# EAGLE board smoothieboard-10x10-1210 (EAGLE 9.6.0), part 1 of 3
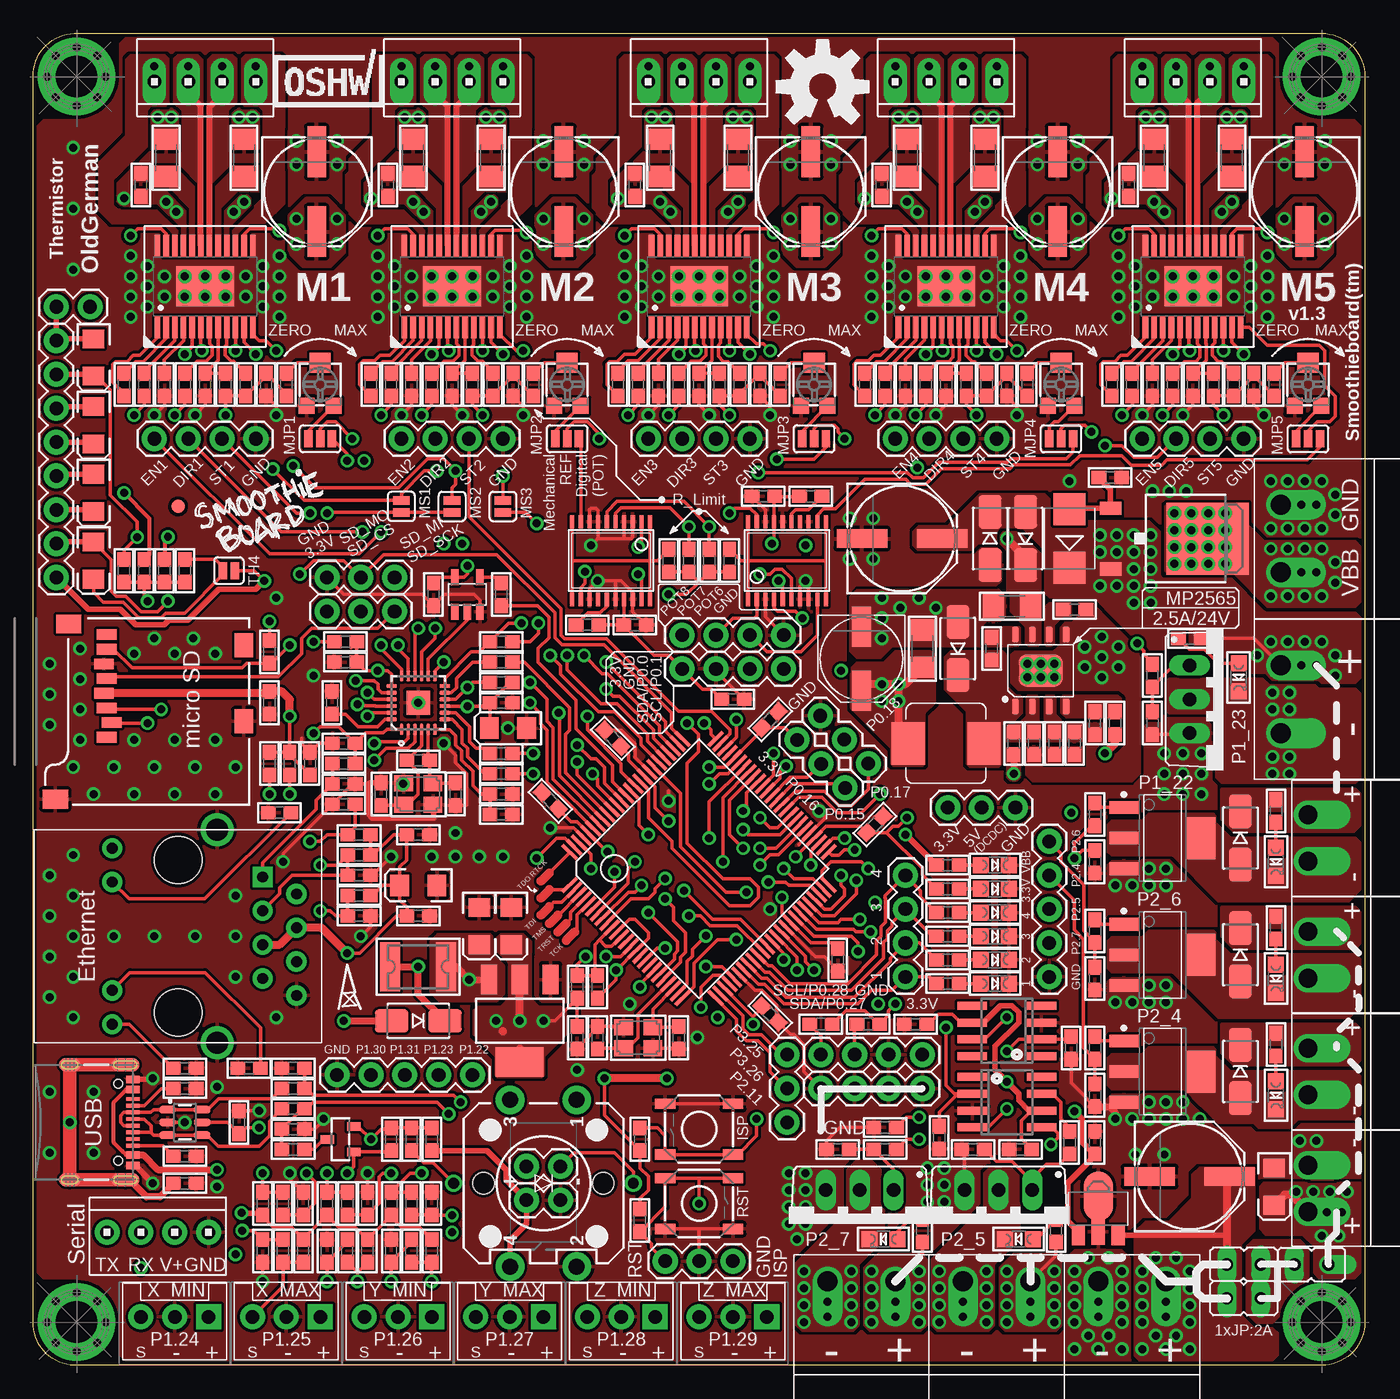
[diagram p4: board, top side]
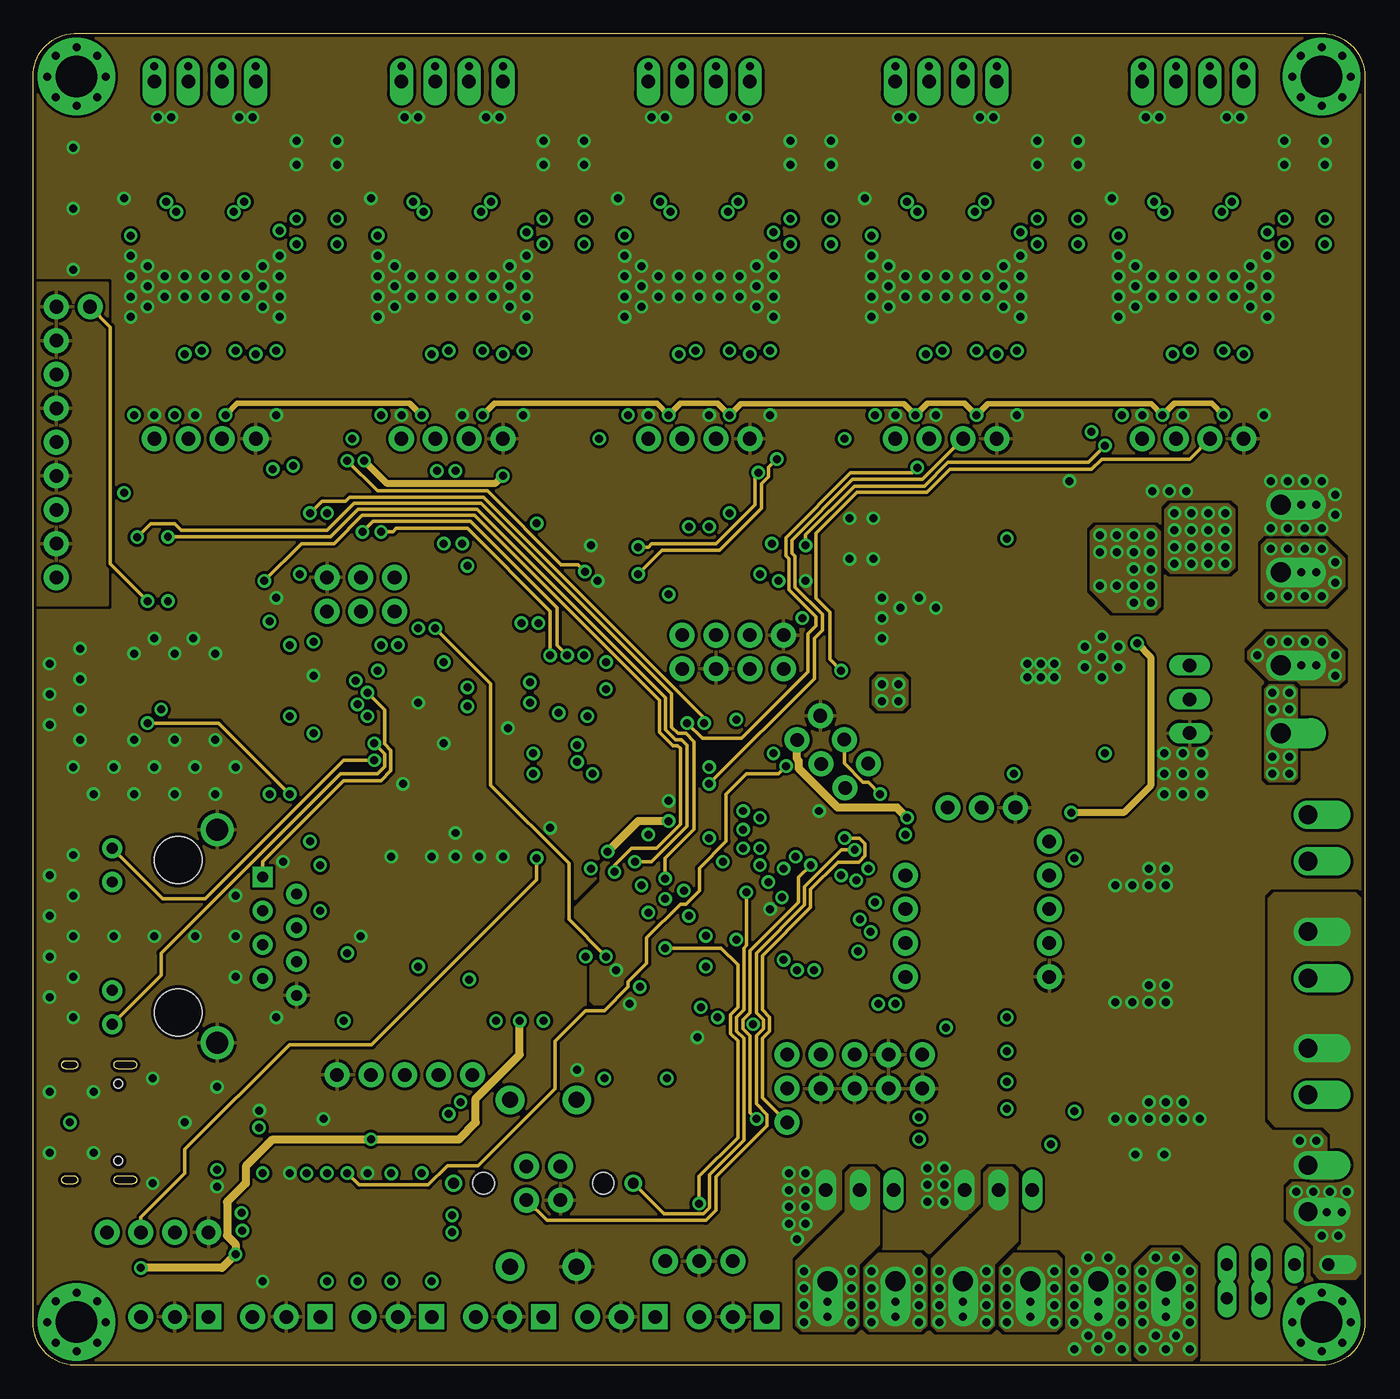
[diagram p5: board, inner layer Route2]
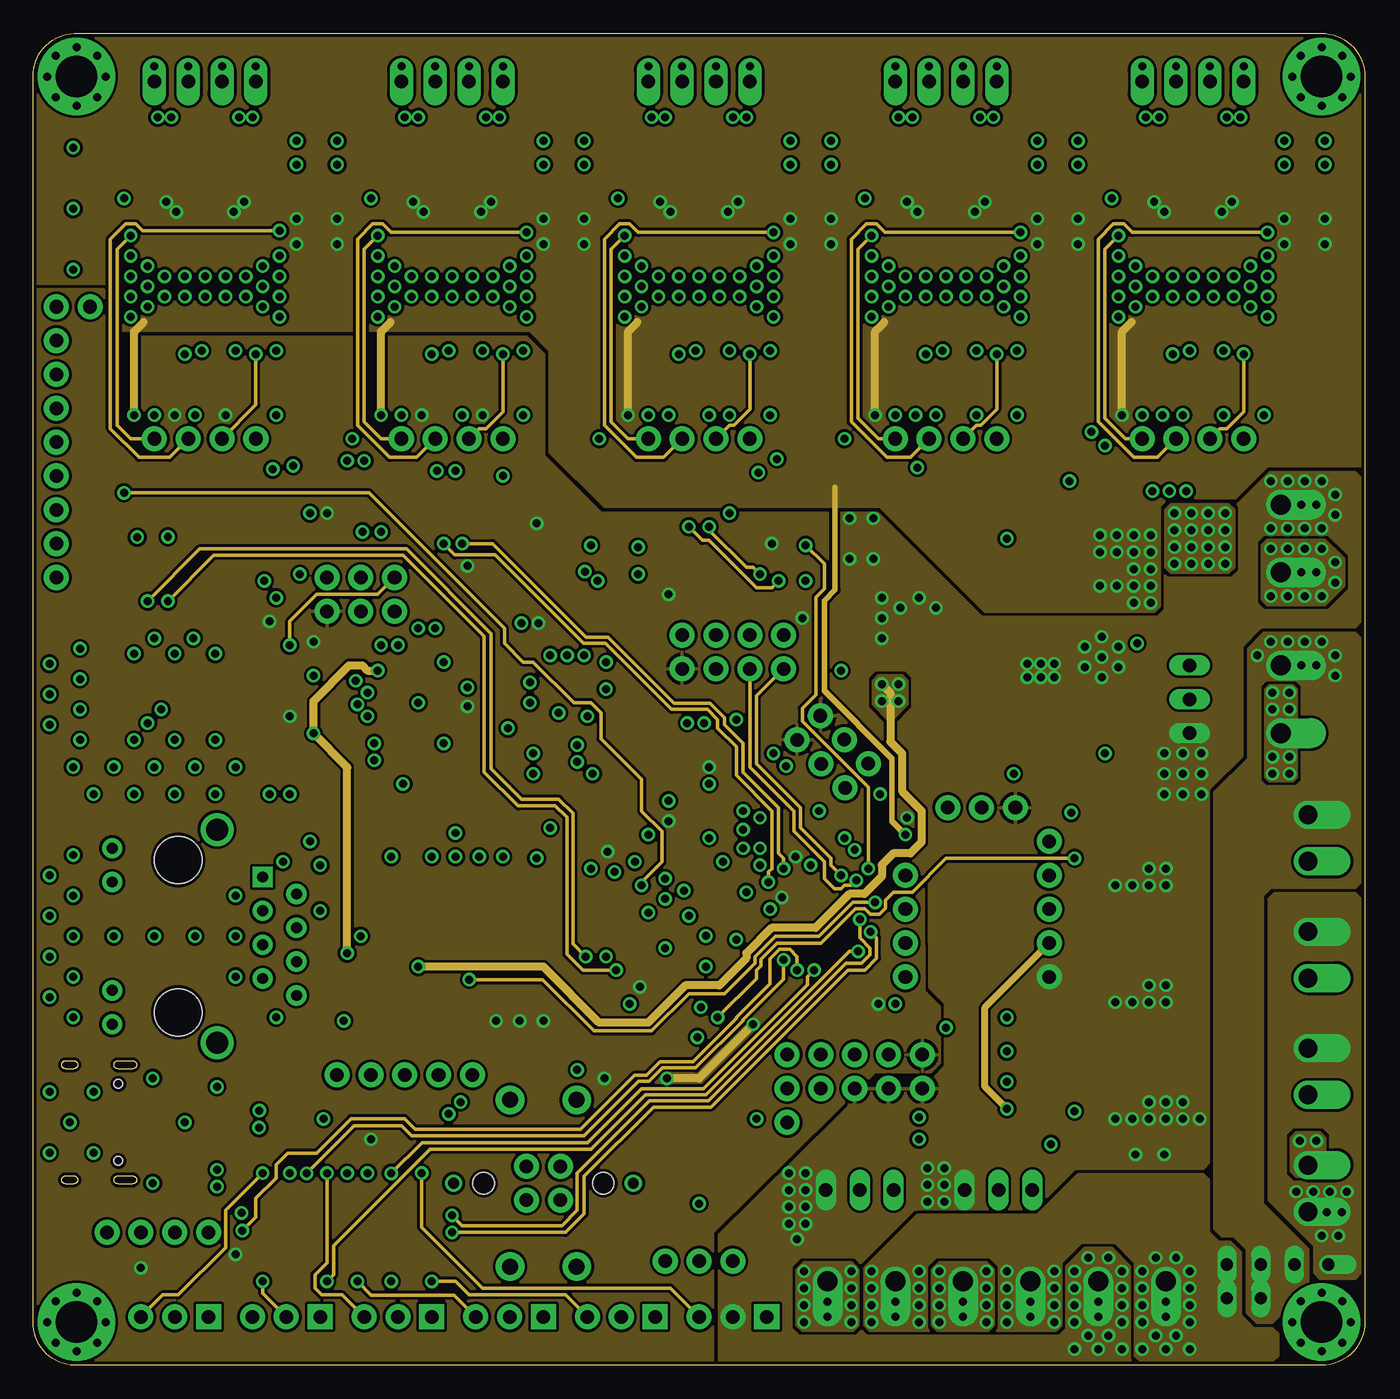
[diagram p6: board, inner layer Route15]
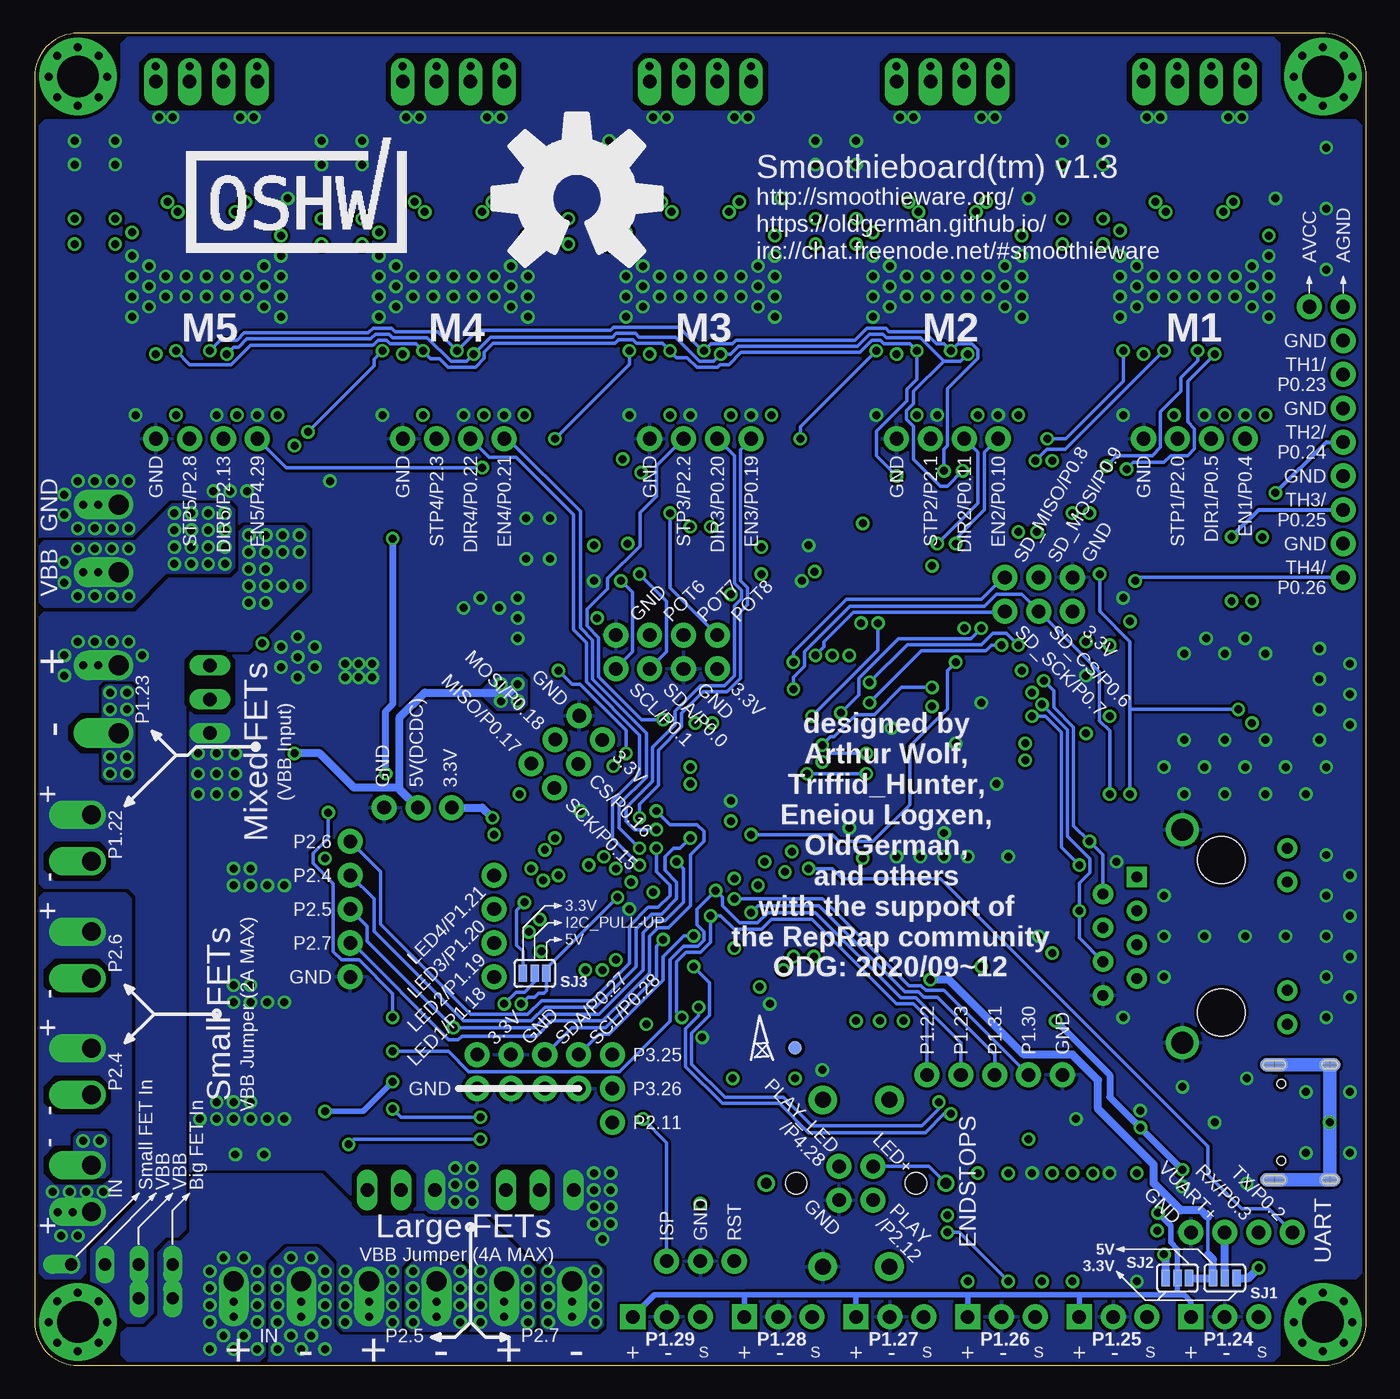
[diagram p7: board, bottom side, seen from below]

Size 99.97 x 99.97 mm. Coordinates in mm from the lower left corner, seen from the top.
Outline: 3.07,0 arc-90 0,3.25 0,96.72 arc-90 3.07,99.97 96.72,99.97 arc-90 99.97,96.72 99.97,3.25 arc-90 96.72,0 3.07,0
Copper layers (1*2+15*16): Top 0.035mm / dielectric 0.5mm / Route2 0.035mm / dielectric 0.5mm / Route15 0.035mm / dielectric 0.5mm / Bottom 0.035mm
Design rules "default *": minimum track width 10mil, minimum drill 12mil, track to track 8mil, track to pad 8mil, pad to pad 6mil, via to via 6mil, smd to smd 6mil, copper to edge 10mil, drill to drill 8mil, minimum pad ring 10mil, minimum via ring 8mil, stop-mask expansion 0mil, vias tented up to drill 0.61mm, thermal gap 10mil
tRestrict: 64 lines
bRestrict: area 61,11.4 to 65.6,14.9; area 71.5,11.4 to 76,14.9; area 85,49 to 88.6,53.5; area 8,94.3 to 17.9,98.4; area 26.5,94.3 to 36.4,98.4; area 63.6,94.3 to 73.5,98.4; area 82.1,94.3 to 92,98.4; area 94.4,19 to 99.2,21.6; area 94.4,27.7 to 99.2,30.4; area 94.4,36.5 to 99.2,39.2; area 95.1,46.1 to 97.4,48.8; area 94.7,13.7 to 99.2,16.4; 1 more areas; 28 lines

## Footprints (pad centres in the part's own frame; a part is rotated, then mirrored left to right if it is on the bottom)
0603 = smd 1.1 x 1: 1 -0.85,0; 2 0.85,0
EIA3216 = smd 1.4 x 1.6: A 1.4,0; C -1.4,0
PANASONIC_E = smd 3.8 x 1.4: + 3,0; - -3,0
C0603 = smd 1.1 x 1: 1 -0.85,0; 2 0.85,0
PANASONIC_D = smd 3 x 1.4: + 2.4,0; - -2.4,0
1206 = smd 1.6 x 1.8: 1 -1.4,0; 2 1.4,0
SMAF = smd 2.5 x 1.7: A 2,0; C -2,0
SMB = smd 2.4 x 2.4: A 2.2,0; C -2.2,0
FIDUCIAL_1MM = smd 1 x 1: 1 0,0
LQFP100 = smd 0.27 x 1.5: 1 -6,-7.75; 2 -5.5,-7.75; 3 -5,-7.75; 4 -4.5,-7.75; 5 -4,-7.75; 6 -3.5,-7.75; 7 -3,-7.75; 8 -2.5,-7.75; 9 -2,-7.75; 10 -1.5,-7.75; 11 -1,-7.75; 12 -0.5,-7.75; 13 0,-7.75; 14 0.5,-7.75; 15 1,-7.75; 16 1.5,-7.75; 17 2,-7.75; 18 2.5,-7.75; 19 3,-7.75; 20 3.5,-7.75; 21 4,-7.75; 22 4.5,-7.75; 23 5,-7.75; 24 5.5,-7.75; 25 6,-7.75; 51 6,7.75; 52 5.5,7.75; 53 5,7.75; 54 4.5,7.75; 55 4,7.75; 56 3.5,7.75; 57 3,7.75; 58 2.5,7.75; 59 2,7.75; 60 1.5,7.75; 61 1,7.75; 62 0.5,7.75; 63 0,7.75; 64 -0.5,7.75; 65 -1,7.75; 66 -1.5,7.75; 67 -2,7.75; 68 -2.5,7.75; 69 -3,7.75; 70 -3.5,7.75; 71 -4,7.75; 72 -4.5,7.75; 73 -5,7.75; 74 -5.5,7.75; 75 -6,7.75 | smd 1.5 x 0.27: 26 7.75,-6; 27 7.75,-5.5; 28 7.75,-5; 29 7.75,-4.5; 30 7.75,-4; 31 7.75,-3.5; 32 7.75,-3; 33 7.75,-2.5; 34 7.75,-2; 35 7.75,-1.5; 36 7.75,-1; 37 7.75,-0.5; 38 7.75,0; 39 7.75,0.5; 40 7.75,1; 41 7.75,1.5; 42 7.75,2; 43 7.75,2.5; 44 7.75,3; 45 7.75,3.5; 46 7.75,4; 47 7.75,4.5; 48 7.75,5; 49 7.75,5.5; 50 7.75,6; 76 -7.75,6; 77 -7.75,5.5; 78 -7.75,5; 79 -7.75,4.5; 80 -7.75,4; 81 -7.75,3.5; 82 -7.75,3; 83 -7.75,2.5; 84 -7.75,2; 85 -7.75,1.5; 86 -7.75,1; 87 -7.75,0.5; 88 -7.75,0; 89 -7.75,-0.5; 90 -7.75,-1; 91 -7.75,-1.5; 92 -7.75,-2; 93 -7.75,-2.5; 94 -7.75,-3; 95 -7.75,-3.5; 96 -7.75,-4; 97 -7.75,-4.5; 98 -7.75,-5; 99 -7.75,-5.5; 100 -7.75,-6
ETSSOP24 = smd 0.426 x 1.65: P01 -3.575,-3.05; P02 -2.925,-3.05; P03 -2.275,-3.05; P04 -1.625,-3.05; P05 -0.975,-3.05; P06 -0.325,-3.05; P07 0.325,-3.05; P08 0.975,-3.05; P09 1.625,-3.05; P10 2.275,-3.05; P11 2.925,-3.05; P12 3.575,-3.05; P13 3.575,3.05; P14 2.925,3.05; P15 2.275,3.05; P16 1.625,3.05; P17 0.975,3.05; P18 0.325,3.05; P19 -0.325,3.05; P20 -0.975,3.05; P21 -1.625,3.05; P22 -2.275,3.05; P23 -2.925,3.05; P24 -3.575,3.05 | smd 4.32 x 3: P$1 0,0
TSSOP20 = smd 0.305 x 0.991: 1 -2.925,-2.918; 2 -2.275,-2.918; 3 -1.625,-2.918; 4 -0.975,-2.918; 5 -0.325,-2.918; 6 0.325,-2.918; 7 0.975,-2.918; 8 1.625,-2.918; 9 2.275,-2.918; 10 2.925,-2.918; 11 2.925,2.918; 12 2.275,2.918; 13 1.625,2.918; 14 0.975,2.918; 15 0.325,2.918; 16 -0.325,2.918; 17 -0.975,2.918; 18 -1.625,2.918; 19 -2.275,2.918; 20 -2.925,2.918
SOT23-5 = smd 0.55 x 1.2: 1 -0.95,-1.3; 2 0,-1.3; 3 0.95,-1.3; 4 0.95,1.3; 5 -0.95,1.3
QFN24_4MM = smd 0.8 x 0.28: 1 -2,1.25; 2 -2,0.75; 3 -2,0.25; 4 -2,-0.25; 5 -2,-0.75; 6 -2,-1.25; 13 2,-1.25; 14 2,-0.75; 15 2,-0.25; 16 2,0.25; 17 2,0.75; 18 2,1.25 | smd 0.28 x 0.8: 7 -1.25,-2; 8 -0.75,-2; 9 -0.25,-2; 10 0.25,-2; 11 0.75,-2; 12 1.25,-2; 19 1.25,2; 20 0.75,2; 21 0.25,2; 22 -0.25,2; 23 -0.75,2; 24 -1.25,2 | smd 1.778 x 1.778: THERM 0,0
SOT223 = smd 1.219 x 2.235: 1 -2.311,-3.099; 2 0,-3.099; 3 2.311,-3.099 | smd 3.6 x 2.2: 4 0,3.099
SOT89 = smd 1 x 1.5: 1 -1.499,-1.981; 3 1.499,-1.981 | smd 1 x 2: 2 0,-1.727 | smd 2.2 x 3.7: 2@1 0,0.94
SOIC8 = smd 0.6 x 2.2: 1 -1.905,-2.6; 2 -0.635,-2.6; 3 0.635,-2.6; 4 1.905,-2.6; 5 1.905,2.6; 6 0.635,2.6; 7 -0.635,2.6; 8 -1.905,2.6
10X04MTA = drill 1.016 pad 1.778 long: 1 3.81,0; 2 1.27,0; 3 -1.27,0; 4 -3.81,0
10X04MTA_ROUND = drill 1.016 pad 1.88: 1 3.81,0; 2 1.27,0; 3 -1.27,0; 4 -3.81,0
USB-C-16P = smd 0.28 x 1: A5 -1.25,-0.34; A6 -0.25,-0.34; A7 0.25,-0.34; A8 1.25,-0.34; B5 1.75,-0.34; B6 0.75,-0.34; B7 -0.75,-0.34; B8 -1.75,-0.34 | smd 0.56 x 1: GND -3.225,-0.34; GND2 3.225,-0.34; VBUS1 -2.45,-0.34; VBUS2 2.45,-0.34 | smd 1 x 2.1: SHLD1 -4.32,-0.915; SHLD2 4.32,-0.915 | smd 1 x 2.1 bottom: SHLD3 -4.32,-0.915; SHLD4 4.32,-0.915 | smd 1 x 1.6: SHLD5 -4.32,-5.095; SHLD8 4.32,-5.095 | smd 1 x 1.6 bottom: SHLD6 -4.32,-5.095; SHLD7 4.32,-5.095 | hole 0.65: -2.89,-1.445; 2.89,-1.445
1X04 = drill 1.016 pad 1.88: 1 0,0; 2 2.54,0; 3 5.08,0; 4 7.62,0
1X03 = drill 1.016 pad 1.88: 1 0,0; 2 2.54,0; 3 5.08,0
JP1 = drill 0.914 long: 1 0,-1.27; 2 0,1.27
SJ_2S = smd 0.635 x 1.27: 1 -0.447,0; 2 0.447,0
MOLEX-1X3 = drill 1.016 pad 1.88 square: 1 -2.54,0 | drill 1.016 pad 1.88: 2 0,0; 3 2.54,0
1X02 = drill 1.016 pad 1.88: 1 0,0; 2 2.54,0
1X03@1 = drill 1.016 pad 1.88: 1 0,0; 2 2.54,0; 3 5.08,0
JP1-SMSP = drill 0.914 offset: 1 0,-1.27 | drill 0.914 long: 2 0,1.27
1X05 = drill 1.016 pad 1.88: 1 0,0; 2 2.54,0; 3 5.08,0; 4 7.62,0; 5 10.16,0
L0630 = smd 2.5 x 3.2: 1 -2.85,0; 2 2.85,0
CHIPLED_0805 = smd 1.2 x 1.2: A 0,-1.05; C 0,1.05
1715250000 = drill 1.5 offset: P$1 -2.54,0; P$2 2.54,0
PTC1812 = smd 1.5 x 3.7: P$1 -2.1,0; P$2 2.1,0
SOT23-R = smd 0.635 x 1.016: 1 -0.95,-1; 2 0.95,-1; 3 0,1
CRYSTAL_3.2X2.5 = smd 1.4 x 1.2: 1 -1.1,-0.8; 2 1.1,0.8; GND1 -1.1,0.8; GND2 1.1,-0.8
SOT230P700X160-4N = smd 2.15 x 0.95: 1 -2.9,2.3; 2 -2.9,0; 3 -2.9,-2.3 | smd 2.15 x 3.15: 4 2.9,0
TO220BV = drill 1.016 long: D 0,-2.54; G -2.54,-2.54; S 2.54,-2.54
TO252 = smd 1 x 1.6: 1 -2.28,-4.8; 2 2.28,-4.8 | smd 5.4 x 6.2: 3 0,2.5
HR911105A = drill 0.813 pad 1.524: G+ 4.953,-6.604; G- 4.953,-4.064; GND -8.89,4.445; NC -6.35,3.175; P4 -8.89,-0.635; P5 -6.35,0.635; RD+ -6.35,-1.905; RD- -8.89,1.905; TD- -8.89,-3.175; Y+ 4.953,6.604; Y- 4.953,4.064 | drill 1.651 pad 2.159: SHIELD0 -2.921,8.001; SHIELD1 -2.921,-8.001 | drill 0.813 pad 1.524 square: TD+ -6.35,-4.445 | hole 3.556: 0,-5.715; 0,5.715
TACTILE_SWITCH_SMD = smd 1.524 x 0.762: 1 -2.54,1.905; 2 2.54,1.905; 3 -2.54,-1.905; 4 2.54,-1.905
TACTILE-PTH-LED-12MM = drill 1.2 pad 2.159: 1 -6.25,2.5; 2 6.25,2.5; 3 -6.25,-2.5; 4 6.25,-2.5 | drill 0.8: A 0,6.75; C 0,-6.75 | hole 1.6: 0,4.5; 0,-4.5
SJ_3 = smd 0.635 x 1.27: 1 -0.889,0; 2 0,0; 3 0.889,0
1X08 = drill 1.016 pad 1.88: 1 0,0; 2 2.54,0; 3 5.08,0; 4 7.62,0; 5 10.16,0; 6 12.7,0; 7 15.24,0; 8 17.78,0
MICRO-SD-SOCKET-PP = smd 0.8 x 1.5: 1 -8.94,10.7; 2 -7.84,10.3; 3 -6.74,10.7; 4 -5.64,10.9; 5 -4.54,10.7; 6 -3.44,10.9; 7 -2.34,10.7; 8 -1.24,10.7 | smd 1.8 x 1.4: CD1 -2.05,0.4; CD2 -7.75,0.4 | smd 1.4 x 1.9: GND1 -13.6,14.55; GND3 -0.45,13.55
ESOP8L-1.27-5X3.9MM = smd 0.5 x 1.2: 1 -1.905,-2.7; 2 -0.635,-2.7; 3 0.635,-2.7; 4 1.905,-2.7; 5 1.905,2.7; 6 0.635,2.7; 7 -0.635,2.7; 8 -1.905,2.7 | smd 3.3 x 2.4: PAD 0,0
5.08-MOTHER_NO-SIDE = drill 1.5 offset: P$1 -2.54,0; P$2 2.54,0
SUN_HOLE_M3 = drill 3.1 pad 5.8: P$1 0,0 | drill 0.6 pad 1: P$2 0,2.2; P$3 0,-2.2; P$4 -2.2,0; P$5 2.2,0; P$6 1.55,1.55; P$7 1.55,-1.55; P$8 -1.55,1.55; P$9 -1.55,-1.55
SOT23-6 = smd 0.55 x 1.2: 1 0.95,1.3; 2 0,1.3; 3 -0.95,1.3; 4 -0.95,-1.3; 5 0,-1.3; 6 0.95,-1.3
TRIMPOT_BOURNS3MM = smd 1.2 x 1.2: A -1,-1.6; S 1,-1.6 | smd 1.6 x 1.5: E 0,1.65
180G-2 = drill 1.422 offset: 1 1.75,0; 2 -1.75,0

## Placement (x,y rotation side)
C1  .1uF  [0603]  20.78,45.16 270 top
C2  12pF  [0603]  42.37,24.59 90 top
C3  12pF  [0603]  48.46,24.59 270 top
C4  18pF  [0603]  19.51,22.3 0 top
C5  18pF  [0603]  19.51,17.73 180 top
C6  .1uF  [0603]  42.37,28.4 270 top
C7  10uF  [EIA3216]  35.89,32.97 270 top
C8  .1uF  [0603]  63.2,40.59 225 top
C9  .1uF  [0603]  60.4,30.43 90 top
C10  .1uF  [0603]  55.32,26.37 135 top
C11  .1uF  [0603]  38.81,42.37 315 top
C12  .1uF  [0603]  43.51,47.07 315 top
C13  .1uF  [0603]  40.84,24.59 90 top
C14  .1uF  [0603]  55.32,48.46 225 top
C15  .22uF  [0603]  9.86,73.61 90 top
C16  .22uF  [0603]  28.4,73.61 90 top
C17  .1uF  [0603]  8.33,73.61 90 top
C18  .1uF  [0603]  26.87,73.61 90 top
C19  .1uF  [0603]  6.81,73.61 270 top
C20  .1uF  [0603]  25.35,73.61 270 top
C21  10uF  [EIA3216]  4.52,75.64 270 top
C22  10uF  [EIA3216]  4.52,70.56 270 top
C23  10uF  [EIA3216]  4.52,65.48 270 top
C24  10uF  [EIA3216]  4.52,60.4 270 top
C25  .1uF  [0603]  17.48,73.61 270 top
C26  100uF/50V  [PANASONIC_E]  21.29,88.09 270 top
C27  .1uF  [0603]  8.08,88.6 90 top
C28  .1uF  [0603]  36.02,73.61 270 top
C29  100uF/50V  [PANASONIC_E]  39.83,88.09 270 top
C30  .1uF  [0603]  26.62,88.6 90 top
C31  .1uF  [0603]  45.16,55.58 180 top
C32  .22uF  [0603]  46.94,73.61 90 top
C33  .22uF  [0603]  65.48,73.61 90 top
C34  .1uF  [0603]  45.42,73.61 90 top
C35  .1uF  [0603]  63.96,73.61 90 top
C36  .1uF  [0603]  43.89,73.61 270 top
C37  .1uF  [0603]  62.43,73.61 270 top
C38  .1uF  [0603]  54.56,73.61 270 top
C39  100uF/50V  [PANASONIC_E]  58.37,88.09 270 top
C40  .1uF  [0603]  63.7,88.6 90 top
C41  .1uF  [0603]  73.1,73.61 270 top
C42  100uF/50V  [PANASONIC_E]  95.45,88.09 270 top
C43  .1uF  [0603]  45.16,88.6 90 top
C44  .1uF  [0603]  30.05,57.86 270 top
C45  10uF  [EIA3216]  28.91,36.02 180 top
C46  .1uF  [0603]  23.32,46.69 180 top
C47  .1uF  [0603]  23.44,52.78 180 top
C48  1uF  [C0603]  35.13,41.35 0 top
C49  470pF  [C0603]  35.13,42.88 0 top
C50  10uF  [EIA3216]  35.64,47.83 180 top
C51  .1uF  [0603]  35.13,49.73 0 top
C52  .1uF  [0603]  28.91,39.83 0 top
C53  .1uF  [0603]  28.91,33.73 0 top
C54  18pF  [0603]  23.32,43.64 0 top
C55  18pF  [0603]  23.32,42.11 180 top
C56  18pF  [0603]  24.46,36.78 0 top
C57  18pF  [0603]  24.46,33.73 0 top
C58  12pF  [0603]  31.7,42.88 270 top
C59  12pF  [0603]  26.11,42.88 90 top
C60  100uF/50V  [PANASONIC_E]  86.82,14.17 0 top
C61  10uF  [EIA3216]  93.17,13.41 270 top
C62  .1uF  [0603]  79.71,16.71 90 top
C63  100uF/50V  [PANASONIC_E]  65.23,62.05 0 top
C64  10uF  [EIA3216]  33.48,32.97 270 top
C65  .1uF  [0603]  52.53,49.99 0 top
C66  .1uF  [0603]  74.12,16.21 180 top
C67  1uF  [C0603]  17.73,49.73 90 top
C68  .1uF  [0603]  54.81,65.23 0 top
C69  .1uF  [0603]  80.98,73.61 270 top
C70  .1uF  [0603]  82.5,73.61 90 top
C71  .1uF  [0603]  91.64,73.61 270 top
C72  .22uF  [0603]  84.02,73.61 90 top
C73  .1uF  [0603]  82.25,88.6 90 top
C74  100uF/50V  [PANASONIC_E]  76.91,88.09 270 top
C75  .1uF  [0603]  66.24,25.6 180 top
C78  .1uF  [0603]  20.27,12.14 90 top
C79  .1uF  [0603]  17.22,8.59 270 top
C80  .1uF  [0603]  25.1,12.14 90 top
C81  .1uF  [0603]  22.05,8.59 90 top
C82  .1uF  [0603]  26.87,8.59 90 top
C83  .1uF  [0603]  29.92,12.14 90 top
C84  100uF/25V  [PANASONIC_D]  62.18,53.04 270 top
C85  .1uF  [0603]  15.44,18.24 270 top
C90  10uF/50V  [1206]  73.48,56.97 180 top
C91  22uF/16V  [1206]  66.75,53.8 90 top
C92  150pF  [0603]  76.66,46.69 270 top
C93  .1uF  [0603]  71.96,53.8 90 top
D1  SS34F  [SMAF]  28.91,25.86 180 top
D2  SS34F  [SMAF]  69.42,53.8 90 top
D3  SS34F  [SMAF]  74.5,62.05 90 top
D4  SS110F  [SMAF]  71.83,62.05 270 top
D5  15V  [SMB]  77.8,62.05 90 top
D7  SS34F  [SMAF]  90.63,22.05 270 top
D8  SS34F  [SMAF]  90.63,30.81 270 top
D9  SS34F  [SMAF]  90.63,39.57 270 top
FB1  [0603]  23.44,54.31 0 top
FID1  FIDUCIAL  [FIDUCIAL_1MM]  10.87,64.47 0 top
FID2  FIDUCIAL  [FIDUCIAL_1MM]  42.88,23.83 0 bottom
IC1  LPC1769  [LQFP100]  49.99,37.29 315 top
IC2  A5984  [ETSSOP24]  12.9,80.98 0 top
IC3  A5984  [ETSSOP24]  31.45,80.98 0 top
IC4  MCP44X1  [TSSOP20]  43.38,60.4 180 top
IC5  A5984  [ETSSOP24]  49.99,80.98 0 top
IC6  A5984  [ETSSOP24]  68.53,80.98 0 top
IC7  [SOT23-5]  32.59,57.86 0 top
IC8  [QFN24_4MM]  28.91,49.73 90 top
IC9  MCP44X1  [TSSOP20]  56.59,60.4 0 top
IC10  LM1117-3.3V  [SOT223]  36.53,25.86 180 top
IC11  78L12F  [SOT89]  79.96,11.76 0 top
IC12  A5984  [ETSSOP24]  87.07,80.98 0 top
IC14  TC4427  [SOIC8]  73.1,19.76 270 top
IC15  TC4427  [SOIC8]  73.1,25.1 90 top
J1  [10X04MTA]  12.9,96.34 0 top
J2  [10X04MTA]  31.45,96.34 0 top
J3  [10X04MTA]  49.99,96.34 0 top
J4  [10X04MTA]  68.53,96.34 0 top
J5  [10X04MTA]  87.07,96.34 0 top
J6  [10X04MTA_ROUND]  9.35,9.98 180 top
J12  [USB-C-16P]  7.82,18.24 270 top
JP1  [1X04]  66.75,23.32 180 top
JP2  455-1750-1-ND  [1X03]  57.35,46.94 315 top
JP3  455-1750-1-ND  [1X03]  62.69,45.16 135 top
JP4  455-1750-1-ND  [1X03]  22.05,56.59 0 top
JP5  [1X03]  68.66,41.86 0 top
JP6  455-1750-1-ND  [1X03]  27.13,59.13 180 top
JP7  [1X04]  9.09,69.55 0 top
JP8  [1X04]  48.72,52.27 0 top
JP9  [1X04]  27.64,69.55 0 top
JP10  [1X04]  66.75,20.78 180 top
JP11  [JP1]  90.88,7.57 270 top
JP12  [1X04]  46.18,69.55 0 top
JP13  [SJ_2S]  14.68,59.64 180 top
JP14  [MOLEX-1X3]  19,3.63 180 top
JP15  [1X04]  64.72,69.55 0 top
JP16  [MOLEX-1X3]  27.38,3.63 180 top
JP18  [1X04]  83.26,69.55 0 top
JP19  [MOLEX-1X3]  35.76,3.63 180 top
JP20  [1X03]  56.59,23.32 270 top
JP21  [MOLEX-1X3]  44.15,3.63 180 top
JP22  [MOLEX-1X3]  52.53,3.63 180 top
JP23  [1X02]  37.03,12.4 0 top
JP24  [1X02]  37.03,14.94 0 top
JP25  [1X03@1]  47.45,7.82 0 top
JP26  [MOLEX-1X3]  10.62,3.63 180 top
JP27  [JP1]  90.88,5.03 270 top
JP28  [JP1-SMSP]  95.96,7.57 90 top
JP29  [1X04]  65.48,29.16 90 top
JP30  [SJ_2S]  31.45,64.47 270 top
JP31  [SJ_2S]  27.64,64.47 90 top
JP32  [1X05]  32.97,21.79 180 top
JP33  [1X05]  76.28,39.32 270 top
JP34  [1X04]  56.34,54.81 180 top
JP35  [1X02]  4.27,79.45 180 top
JP36  [SJ_2S]  35.26,64.47 270 top
L1  [0603]  40.84,28.4 270 top
L3  15uH  [L0630]  68.53,46.69 180 top
LED1  [CHIPLED_0805]  72.21,28.65 270 top
LED2  [CHIPLED_0805]  72.21,30.43 270 top
LED3  [CHIPLED_0805]  72.21,32.21 270 top
LED4  [CHIPLED_0805]  72.21,33.99 270 top
LED5  [CHIPLED_0805]  93.29,20.27 180 top
LED6  [CHIPLED_0805]  93.29,29.03 180 top
LED7  [CHIPLED_0805]  73.99,9.47 90 top
LED8  [CHIPLED_0805]  63.83,9.47 90 top
LED9  [CHIPLED_0805]  72.21,35.76 270 top
LED10  [CHIPLED_0805]  72.21,37.54 270 top
LED11  [CHIPLED_0805]  93.29,37.8 180 top
LED12  [CHIPLED_0805]  90.5,51.64 180 top
POWER  5.08MM_CONN  [1715250000]  93.68,62.05 90 top
PTC1  0.75A  [PTC1812]  28.91,29.92 180 top
Q1  [SOT23-R]  23.06,16.97 90 top
Q2  12MHz  [CRYSTAL_3.2X2.5]  45.42,24.59 180 top
Q3  25MHz  [CRYSTAL_3.2X2.5]  28.91,42.88 0 top
Q4  BUK9832-55A  [SOT230P700X160-4N]  84.79,39.57 0 top
Q5  IRF3205  [TO220BV]  89.36,49.99 270 top
Q6  IRF3205  [TO220BV]  72.47,10.62 180 top
Q7  IRF3205  [TO220BV]  62.05,10.62 180 top
Q8  BUK9832-55A  [SOT230P700X160-4N]  84.79,22.05 0 top
Q9  BUK9832-55A  [SOT230P700X160-4N]  84.79,30.81 0 top
Q10  AOD4185  [TO252]  85.67,62.05 270 top
R1  10K  [0603]  19.25,45.16 90 top
R2  10K  [0603]  17.73,53.54 90 top
R3  10K  [0603]  17.73,45.16 90 top
R4  100K  [0603]  58.37,65.23 180 top
R5  2.2K  [0603]  59.13,25.6 0 top
R6  2.2K  [0603]  62.69,25.6 0 top
R7  1.5K  [0603]  19.51,16.21 0 top
R8  33R  [0603]  19.51,19.25 0 top
R9  33R  [0603]  19.51,20.78 0 top
R10  1K  [0603]  68.66,28.65 180 top
R11  1K  [0603]  68.66,30.43 180 top
R12  1K  [0603]  68.66,32.21 180 top
R13  1K  [0603]  68.66,33.99 180 top
R14  10K  [0603]  45.54,10.87 90 top
R15  10K  [0603]  45.54,16.97 270 top
R16  10K  [0603]  29.92,16.97 90 top
R17  330R  [0603]  28.4,16.97 270 top
R18  33K  [0603]  52.27,60.4 270 top
R19  10K  [0603]  87.07,73.61 270 top
R20  10K  [0603]  90.12,73.61 270 top
R21  0.05R  [1206]  89.99,90.63 270 top
R22  NP  [0603]  14.43,73.61 90 top
R23  NP  [0603]  32.97,73.61 270 top
R24  10K  [0603]  15.95,73.61 270 top
R25  10K  [0603]  11.38,73.61 270 top
R26  10K  [0603]  12.9,73.61 270 top
R27  10K  [0603]  31.45,73.61 270 top
R28  10K  [0603]  34.49,73.61 270 top
R29  10K  [0603]  29.92,73.61 270 top
R30  33K  [0603]  47.7,60.4 270 top
R31  0.05R  [1206]  15.82,90.63 270 top
R32  0.05R  [1206]  9.98,90.63 270 top
R33  0.05R  [1206]  34.37,90.63 270 top
R34  0.05R  [1206]  28.52,90.63 270 top
R35  2.2K  [0603]  50.75,60.4 270 top
R36  2.2K  [0603]  49.23,60.4 270 top
R37  100K  [0603]  41.61,55.58 0 top
R38  NP  [0603]  51.51,73.61 270 top
R39  NP  [0603]  70.05,73.61 270 top
R40  10K  [0603]  49.99,73.61 270 top
R41  10K  [0603]  53.04,73.61 270 top
R42  10K  [0603]  48.46,73.61 270 top
R43  10K  [0603]  68.53,73.61 270 top
R44  10K  [0603]  71.58,73.61 270 top
R45  10K  [0603]  67.01,73.61 270 top
R46  0.05R  [1206]  52.91,90.63 270 top
R47  0.05R  [1206]  47.07,90.63 270 top
R48  0.05R  [1206]  71.45,90.63 270 top
R49  0.05R  [1206]  65.61,90.63 270 top
R50  330R  [0603]  16.21,22.3 0 top
R51  22R  [0603]  35.13,57.86 270 top
R52  1.5K  [0603]  35.13,54.31 0 top
R53  10K  [0603]  35.13,51.26 0 top
R54  49.9R  [0603]  23.32,45.16 180 top
R55  49.9R  [0603]  24.46,39.83 180 top
R56  49.9R  [0603]  24.46,38.3 180 top
R57  49.9R  [0603]  24.46,35.26 180 top
R58  22R  [0603]  35.13,45.92 0 top
R59  22R  [0603]  35.13,44.4 0 top
R60  22R  [0603]  35.13,52.78 0 top
R61  330R  [0603]  18.49,41.48 0 top
R62  10K  [0603]  11.38,22.3 180 top
R63  12.1K  [0603]  22.43,49.73 270 top
R64  1M  [0603]  28.91,45.42 180 top
R65  8.2K  [0603]  93.29,24.08 270 top
R66  8.2K  [0603]  93.29,32.84 270 top
R67  8.2K  [0603]  76.78,10.11 90 top
R68  8.2K  [0603]  66.75,10.11 90 top
R69  22R  [0603]  77.8,16.71 270 top
R70  22R  [0603]  63.96,16.21 180 top
R71  10K  [0603]  68.02,17.09 90 top
R72  10K  [0603]  63.96,17.86 0 top
R73  22R  [0603]  79.71,23.83 270 top
R74  10K  [0603]  79.71,20.27 270 top
R75  22R  [0603]  79.71,32.59 270 top
R76  10K  [0603]  79.71,29.03 270 top
R77  1K  [0603]  68.66,35.76 180 top
R78  8.2K  [0603]  68.66,37.54 180 top
R79  0.05R  [1206]  84.15,90.63 270 top
R80  NP  [0603]  88.6,73.61 270 top
R81  10K  [0603]  85.55,73.61 270 top
R82  22R  [0603]  79.71,41.35 270 top
R83  10K  [0603]  79.71,37.8 270 top
R84  8.2K  [0603]  93.29,41.61 270 top
R85  8.2K  [0603]  86.82,54.56 180 top
R86  10K  [0603]  84.02,48.21 270 top
R87  10K  [0603]  77.93,23.83 90 top
R88  22R  [0603]  84.02,51.77 90 top
R89  10K  [0603]  80.85,66.62 0 top
R90  10K  [0603]  70.56,16.21 180 top
R91  10K  [0603]  60.4,16.21 180 top
R92  5.6K  [0603]  18.75,12.14 270 top
R93  1K  [0603]  17.22,12.14 270 top
R94  1K  [0603]  20.27,8.59 90 top
R95  5.6K  [0603]  18.75,8.59 90 top
R96  1K  [0603]  22.05,12.14 270 top
R97  5.6K  [0603]  23.57,12.14 270 top
R98  1K  [0603]  25.1,8.59 90 top
R99  5.6K  [0603]  23.57,8.59 90 top
R100  1K  [0603]  29.92,8.59 90 top
R101  5.6K  [0603]  28.4,8.59 90 top
R102  1K  [0603]  26.87,12.14 270 top
R103  5.6K  [0603]  28.4,12.14 270 top
R104  0R  [0603]  11.38,13.67 180 top
R105  10K  [0603]  11.38,20.78 180 top
R106  10K  [0603]  11.38,15.7 180 top
R107  100K  [0603]  26.87,16.97 90 top
R108  4.7K  [0603]  6.81,59.64 90 top
R109  4.7K  [0603]  8.33,59.64 90 top
R110  4.7K  [0603]  9.86,59.64 90 top
R111  4.7K  [0603]  11.38,59.64 90 top
R112  33K  [0603]  19,73.61 270 top
R113  33K  [0603]  37.54,73.61 270 top
R114  33K  [0603]  56.08,73.61 270 top
R115  33K  [0603]  74.63,73.61 270 top
R116  33K  [0603]  93.17,73.61 270 top
R123  210K  [0603]  81.23,48.21 270 top
R124  40.2K  [0603]  79.71,48.21 90 top
R125  100K  [0603]  78.18,46.69 270 top
R126  200K  [0603]  78.18,56.72 180 top
R127  100K  [0603]  73.61,46.69 270 top
R128  17.4K  [0603]  75.13,46.69 270 top
RJ1  HR911105A  [HR911105A]  10.87,32.21 180 top
S1  [TACTILE_SWITCH_SMD]  49.99,12.14 0 top
S2  [TACTILE_SWITCH_SMD]  49.99,17.73 180 top
S3  SWITCH-MOMENTARY-LEDPTH  [TACTILE-PTH-LED-12MM]  38.3,13.67 270 top
SJ1  [SJ_3]  10.62,6.55 180 bottom
SJ2  [SJ_3]  14.17,6.55 0 bottom
SJ3  [SJ_3]  62.43,29.41 180 bottom
SJ4  [SJ_3]  21.54,69.55 0 top
SJ5  [SJ_3]  40.08,69.55 0 top
SJ6  [SJ_3]  58.62,69.55 0 top
SJ7  [SJ_3]  77.17,69.55 0 top
SJ8  [SJ_3]  95.71,69.55 0 top
SL1  [1X08]  1.73,76.91 270 top
U1  USD-SOCKETNEW  [MICRO-SD-SOCKET-PP]  16.21,56.08 90 top
U3  MP2565DN  [ESOP8L-1.27-5X3.9MM]  75.64,52.15 0 top
U$5  5.08MM_CONN-NO-SIDE  [5.08-MOTHER_NO-SIDE]  82.5,6.3 0 top
U$6  5.08MM_CONN-NO-SIDE  [5.08-MOTHER_NO-SIDE]  62.18,6.3 0 top
U$7  5.08MM_CONN  [1715250000]  93.68,49.99 90 top
U$9  OSHW-LOGOH  [OSHW-LOGO-HUGE]  59.26,87.58 0 bottom
U$10  5.08MM_CONN-NO-SIDE  [5.08-MOTHER_NO-SIDE]  72.34,6.3 0 top
U$11  FR000001  [CERT-SMALL-SILK]  22.17,94.44 0 top
U$12  FR000001  [CERT-MED-SILK]  80.34,83.52 0 bottom
U$13  [SUN_HOLE_M3]  3.25,96.72 0 top
U$14  [SUN_HOLE_M3]  96.72,3.25 0 top
U$16  [SUN_HOLE_M3]  96.72,96.72 0 top
U$18  [SUN_HOLE_M3]  3.25,3.25 0 top
U$21  [OSHW-LOGO-L]  59.26,95.96 0 top
VD1  USBLC6-2  [SOT23-6]  11.38,18.24 90 top
VR1  [TRIMPOT_BOURNS3MM]  21.54,73.61 0 top
VR2  [TRIMPOT_BOURNS3MM]  40.08,73.61 0 top
VR3  [TRIMPOT_BOURNS3MM]  58.62,73.61 0 top
VR4  [TRIMPOT_BOURNS3MM]  77.17,73.61 0 top
VR5  [TRIMPOT_BOURNS3MM]  95.71,73.61 0 top
X1  [180G-2]  95.71,13.28 90 top
X7  [180G-2]  95.71,22.05 90 top
X8  [180G-2]  95.71,30.81 90 top
X9  [180G-2]  95.71,39.57 90 top

## Tracks (layer width: path | path; a pad name or v marks a point on that pad's centre or on a via)
3.3V  (via drill 0.6)
  Top 0.254: C9.2 60.4,31.41 60.11,31.7 58.4,31.7 | R14.2 45.54,12.52 46.18,13.16 46.18,14.17 45.54,14.81 R15.2 42.88,18.78 v42.88,21.54 | R1.2 v19.25,48.72 19.25,48.78 | C44.1 30.47,59.13 31.61,59.13 IC7.5 32.34,59.16 32.59,59.41 v32.59,60 | 36.02,74.28 R28.2 R23.2 32.97,72.09 v33.73,71.32 | 36.02,74.28 C28.1 | v29.16,71.32 29.92,72.09 R29.2 | R113.2 36.02,74.28 | 73.1,74.28 R44.2 R39.2 70.05,72.09 v70.82,71.32 | 73.1,74.28 C41.1 | 73.1,74.28 R115.2 | 26.77,17.92 R107.2 | R25.2 11.38,72.09 v10.62,71.32 | v14.43,71.32 R22.1 R24.2 17.48,74.28 C25.1 19,72.94 R112.2 | v47.7,40.84 46.69,41.86 46.69,43.42 IC1.84 44.7,45.4 44.7,45.87 C12.2 | 43.06,38.56 v43.13,38.56 43.06,38.56 | C51.1 34.28,47.87 C50.A | v45.54,28.4 45.54,28.6 IC1.19 | C65.1 50.92,50.75 50.24,50.75 JP8.1 47.7,53.29 46.6,53.29 C31.2 | C31.2 R37.2 | IC4.17 44.36,55.62 C31.2 | R42.2 48.46,72.09 v47.7,71.32 | v52.27,71.32 51.51,72.09 R38.2 R41.2 53.04,72.94 C38.1 54.56,74.28 R114.2 | R45.2 67.01,72.09 v66.24,71.32 | R81.2 85.55,72.09 v84.79,71.32 | v89.36,71.32 88.6,72.09 R80.2 R20.2 91.64,74.28 | v22.06,63.96 22.12,64.02 JP31.1 JP30.2 | JP36.2 36.97,64.02 v37.8,63.2 | 47.41,21.71 v47.57,21.54 | R77.2 66.75,36.82 66.75,37.31 64.07,39.99 | R1.2 R3.2 | R30.2 R36.2 49.99,58.79 | R18.2 R35.2 49.99,58.79 | v55.45,61.67 55.62,61.84 IC9.17 55.62,65.18 | FB1.1 v21.03,54.31 | C51.1 33.88,49.34 | IC8.9 32.57,49.48 v32.59,49.46 34.01,49.46 C51.1 | v37.92,55.7 37.92,54.94 37.29,54.31 R52.2 | C1.2 19.25,45.84 R1.2 | IC9.4 55.62,56.85 55.87,56.59 57.23,56.59 v57.73,56.08 | R2.2 v17.73,55.83 | IC1.19 | v57.23,38.17 IC1.54 59.53,40.46 62.12,40.46 C8.2 | IC1.28 | 43.06,38.56 IC1.96 40.83,40.79 40.39,40.79 C11.2
  Top 0.254: v54.05,25.6 54.05,26.15 | 54.05,26.15 IC1.28 | C10.2 54.72,26.84 54.05,26.17 54.05,26.15 | v56.21,35.13 56.21,33.89 IC1.42 58.4,31.7 | 58.4,31.7 | 64.07,39.99 64.54,40.46 64.97,40.46 v65.61,41.1 | C8.2 | C8.2 64.07,39.99 | 64.07,39.99 | JP2.1 56.43,47.86 C14.2 54.72,47.68 IC1.71 51.95,44.91 v50.75,44.91 | C51.1 35.8,51.26 R53.2 | v38.3,25.86 39.19,25.86 40.84,27.51 L1.2 C13.2 | R116.2 91.64,74.28 | 91.64,74.28 C71.1 | 55.62,65.18 C68.2 | R4.2 57.47,65.18 55.62,65.18 | R107.2 26.96,17.73 26.11,17.73 v25.35,16.97 24.4,17.92 Q1.2 | 49.99,58.79 49.06,57.86 v47.7,57.86 | R107.2 R17.1 R16.2
  Top 0.61: v36.53,25.86 IC10.2 | v47.57,21.54 v42.88,21.54 | IC10.4 36.53,23.77 | 35.26,25.04 35.26,25.1 | v19.25,48.72 19.25,49.99 18.66,50.58 C67.2 17.59,50.44 U1.4
  Route2 0.406: v89.36,71.32 88.47,72.21 85.67,72.21 v84.79,71.32 83.93,72.18 71.67,72.18 v70.82,71.32 69.93,72.21 67.13,72.21 v66.24,71.32 65.38,72.18 53.13,72.18 v52.27,71.32 51.38,72.21 48.59,72.21 v47.7,71.32 46.81,72.21 34.62,72.21 v33.73,71.32 | v14.43,71.32 15.32,72.21 28.27,72.21 v29.16,71.32
  Route2 0.61: v8.08,7.32 14.17,7.32 v15.19,8.33 15.19,9.09 14.55,9.73 14.55,12.27 15.95,13.67 15.95,14.94 17.98,16.97 v25.35,16.97 31.95,16.97 33.22,18.24 33.22,20.02 36.53,23.32 v36.53,25.86 | v47.7,40.84 45.42,40.84 v43.13,38.56 | v65.61,41.1 64.85,41.86 60.4,41.86 57.48,44.78 57.48,45.37 57.35,45.5 JP2.1
  Route15 0.61: v54.05,25.6 49.99,21.54 v47.57,21.54
  Bottom 0.254: v63.45,27.13 62.94,27.64 62.43,27.64 62.13,27.94 61.73,27.94 61.54,28.12 SJ3.1 61.54,29.79 v56.21,35.13
  Bottom 0.61: SJ1.1 8.84,6.55 v8.08,7.32 | SJ2.1 15.06,8.2 v15.19,8.33 | JP5.1 66.37,41.86 v65.61,41.1
  other vias: 34.75,25.86
  pour Route15: -0.81,80.72 5.28,80.72 5.28,77.17 37.03,77.17 38.3,75.9 38.3,68.28 42.62,63.96 59.64,63.96 59.64,49.1 66.8,41.89 66.88,28.06 68.04,26.9 68.04,22.71 67.39,22.05 63.19,22.05 51,9.98 51,-0.94 -0.81,-0.94
  pour Top (rank 2, no thermals): 33.1,24.84 33.1,26.62 33.35,26.87 35.13,26.87 35.76,27.51 35.76,30.05 34.87,30.94 34.87,32.08 35.13,32.33 36.78,32.33 37.32,31.8 37.3,30.05 37.3,27.5 37.92,26.87 39.57,26.87 39.95,26.49 39.95,24.84 38.3,23.19 38.3,21.79 38.18,21.67 34.87,21.67 34.75,21.79 34.75,23.19
5V  (via drill 0.6)
  Top 0.508: PTC1.P$1 31.77,29.92 v32.73,28.96 IC10.3
  Route15 0.254: v32.73,28.96 38.25,28.96 42.11,25.1 46.43,25.1 49.23,27.89 51.89,27.89 54.18,30.18 54.18,30.68 55.45,31.95 55.46,31.95 55.72,32.21 59,32.21 61.54,34.75 v63.2,34.75
  Bottom 0.254: 11.89,8.33 11.89,11.13 | SJ3.3 63.32,31.06 63.78,31.52 63.78,34.16 v63.2,34.75
  Bottom 0.61: SJ2.3 SJ1.3 11.51,7.95 11.89,8.33 | v32.73,28.96 31.34,28.96 25.7,23.32 22.05,23.32 20.14,21.41 20.14,19.25 15.95,15.06 15.95,13.67 13.92,11.63 12.4,11.63 11.89,11.13
  pour Top (no thermals): 35.26,27.89 34.75,27.38 30.56,27.38 29.92,28.02 29.92,31.83 30.43,32.33 34.24,32.33 34.37,32.21 34.37,30.86 35.26,29.97
5V_IN_FUSE  (via drill 0.6)
  Top 0.508: PTC1.P$2 v28.91,29.92 28.91,27.86 D1.C
  Top 0.61: v64.97,51.13 64.97,47.39 L3.2 | v64.97,51.13 62.67,51.13 C84.+ | v64.97,51.13 65.48,51.13 C91.1 | v80.47,45.92 81.23,46.69 R123.2
  Route15 0.61: v28.91,29.92 38.3,29.92 42.49,25.73 46.17,25.73 48.96,28.52 51.51,28.52 53.54,30.56 53.54,30.95 55.44,32.84 58.74,32.84 61.28,35.38 62.39,35.38 63.7,36.69 63.7,37.56 64.57,38.43 65.86,38.43 66.7,39.26 66.7,41.62 65.23,43.09 65.23,45.92 64.34,46.81 64.34,50.5 v63.7,51.13
  Bottom 0.61: v80.47,45.92 78.56,45.92 76.02,43.38 72.72,43.38 JP5.2 72.59,43.26 72.59,48.59 70.69,50.5 64.34,50.5 v63.7,51.13
  other vias: 63.7,49.86 64.97,49.86
  pour Bottom: 63.45,49.23 63.07,49.61 63.07,51.38 63.45,51.77 65.23,51.77 66.37,50.62 66.37,50.37 65.23,49.23
  pour Top (rank 2, no thermals): 66.75,45.03 64.59,45.03 64.47,45.16 64.47,46.3 61.42,49.35 61.42,52.27 61.93,52.78 63.83,52.78 64.72,53.67 67.26,53.67 67.64,53.29 67.64,49.73 66.88,48.97 66.88,45.16
  pour Route15: 63.07,51.38 63.45,51.77 65.23,51.77 65.61,51.38 65.61,49.61 64.47,48.46 64.21,48.46 63.07,49.61
  pour Route2: 63.07,51.38 63.45,51.77 65.23,51.77 65.61,51.38 65.61,49.61 65.23,49.23 63.45,49.23 63.07,49.61
12VREG  (via drill 0.6)
  Top 0.254: 74.75,19.13 IC14.6 74.94,19.13 74.18,18.36 74.18,17 C66.1 | IC15.6 69.64,25.73 69.02,26.34 67.96,26.34 67.22,25.6 C75.1
  Top 0.406: 74.75,19.13 73.99,19.89 73.99,20.4 v73.1,21.29 72.21,22.17 72.21,23.95 73.99,25.73 73.99,26.49 73.48,27 72.59,27 71.32,25.73 IC15.6 | IC11.1 78.46,10.03 77.69,10.8 77.69,13.72 79.71,15.74 C62.1 79.63,15.86 78.77,16.73 78.77,18.48 v78.18,19.06
  Bottom 0.406: v78.18,19.06 75.32,19.06 v73.1,21.29
AGND  (via drill 0.6)
  Top 0.254: 46.18,32.06 46.18,32.46 45.16,33.48 44.76,33.48 IC1.11 | C6.2 43.76,28.94 v43.76,29.67 43.78,29.67 IC1.15 46.18,32.06 | 46.18,32.06 | C24.C 5.85,60.47 5.85,58.1 6.22,57.73 6.93,57.73 8.1,56.57 9.33,56.57 v10.11,57.35
  Top 0.406: SL1.5 1.86,66.88 C23.C | SL1.7 1.86,61.8 C24.C | SL1.3 1.86,71.96 C22.C | C21.C 1.86,77.04 SL1.1 JP35.2
  Route15 0.254: v43.76,29.67 41.26,29.67 40.06,30.87 40.06,41.12 39.19,41.99 36.4,41.99 33.86,44.53 | v10.11,57.35 13.54,60.78 27.78,60.78 33.86,54.71 33.86,44.53 | 33.86,44.53
  pour Route2: 44.35,28.6 42.88,27.13 42.11,27.13 41.86,27.38 41.86,31.95 40.59,33.22 40.59,34.24 42.62,36.27 42.62,37.54 44.91,39.83 45.42,39.83 47.45,37.8 47.45,33.86 45.8,32.21 45.8,30.43 44.35,28.98
  pour Route2: 5.54,81.23 -1.57,81.23 -1.57,57.1 5.54,57.1
AVCC  (via drill 0.6)
  Top 0.254: R108.1 R109.1 | R109.1 R110.1 R111.1 | v41.48,30.68 40.84,30.05 L1.1 C6.1 42.16,29.45 42.16,31.59 42.51,31.93 | IC1.10 | IC1.10 42.51,31.93 | IC1.12 44.1,32.16 43.41,31.47 42.98,31.47 42.51,31.93 | R109.1 8.33,57.61 v8.59,57.35
  Route2 0.254: JP35.1 5.79,77.93 5.79,60.15 v8.59,57.35
  Route15 0.254: v8.59,57.35 12.5,61.27 28.02,61.27 34.37,54.92 34.37,44.78 36.65,42.49 39.45,42.49 40.52,41.42 40.52,31.64 v41.48,30.68
DIR1  (via drill 0.6)
  Top 0.254: IC2.P14 15.83,84.88 16.24,85.29 18.36,85.29 v18.49,85.17 | v40.08,53.29 40.06,53.27 40.06,52.2 42.63,49.64 43.84,49.64 46.1,47.38 46.1,46.83 IC1.80 | v24.71,62.56 18.62,62.56 JP7.2
  Route2 0.254: v40.08,53.29 39.32,54.05 39.32,56.85 32.82,63.34 25.5,63.34 v24.71,62.56
  Route15 0.254: JP7.2 10.24,68.15 7.95,68.15 5.79,70.31 5.79,84.53 6.93,85.67 7.7,85.67 8.2,85.17 v18.49,85.17
DIR2  (via drill 0.6)
  Top 0.254: v37.03,85.04 36.89,85.18 34.67,85.18 34.37,84.88 IC3.P14 | v56.34,37.29 57.1,36.53 58.53,36.53 IC1.49 | IC1.49
  Route15 0.254: v37.03,85.04 26.87,85.04 26.24,85.67 25.48,85.67 24.33,84.53 24.33,70.56 26.75,68.15 28.78,68.15 JP9.2 | v56.34,37.29 56.34,38.05 55.96,38.43 55.96,41.86 53.29,44.53 53.29,46.69 51.89,48.08 51.89,48.6 50.81,49.68 48.11,49.68 43.16,54.64 41.52,54.64 34.48,61.67 v32.21,61.67
  Bottom 0.254: v32.21,61.67 29.16,64.72 29.16,68.53 JP9.2
DIR3  (via drill 0.6)
  Top 0.254: IC5.P14 52.91,84.88 53.33,85.29 55.32,85.29 v55.58,85.04 | v53.29,40.21 53.67,39.83 56.06,39.83 IC1.58 | IC1.58
  Route15 0.254: JP12.2 47.32,68.15 45.29,68.15 42.88,70.56 42.88,84.53 44.02,85.67 44.78,85.67 45.42,85.04 v55.58,85.04
  Bottom 0.254: v53.29,40.21 54.94,40.21 55.58,40.84 55.58,41.86 53.59,43.85 53.59,46.37 51.89,48.07 51.89,49.1 49.99,51 48.19,51 47.45,51.75 47.45,57.01 46.92,57.54 46.92,58.19 47.45,58.71 47.45,68.28 JP12.2
DIR4  (via drill 0.6)
  Top 0.254: IC6.P14 71.45,84.92 71.83,85.29 73.86,85.29 v74.12,85.04 | 55.32,38.3 v54.56,37.54 | 55.95,38.3 55.32,38.3 | 55.32,38.3 | IC1.56 | IC1.56 55.95,38.3 | 55.95,38.3
  Route15 0.254: v74.12,85.04 63.96,85.04 63.32,85.67 62.56,85.67 61.42,84.53 61.42,70.82 64.08,68.15 65.86,68.15 JP15.2
  Bottom 0.254: v54.56,37.54 56.59,39.57 56.59,42.37 54.56,44.4 54.56,47.31 58.55,51.29 58.55,54.24 59.51,55.21 59.51,63.83 63.83,68.15 65.86,68.15 JP15.2
DIR5  (via drill 0.6)
  Top 0.254: IC12.P14 90,84.92 90.37,85.29 92.41,85.29 v92.66,85.04 | v62.69,37.29 62.18,37.8 59.89,37.8 59.2,37.1 59.2,36.56 IC1.50 | JP18.2 84.4,68.15 82.63,68.15 81.74,69.04 v80.47,69.04
  Route2 0.254: v80.47,69.04 79.2,67.77 68.67,67.77 66.89,65.99 61.65,65.99 57.99,62.33 v57.99,61.54
  Route15 0.254: v92.66,85.04 82.5,85.04 81.86,85.67 81.1,85.67 79.96,84.53 79.96,70.82 82.63,68.15 84.4,68.15 JP18.2 | v57.99,61.54 59.39,60.15 59.39,58.28 58.77,57.66 58.77,50.35 57.73,49.31 57.73,48.34 62.69,43.38 v62.69,37.29
EN
  pour Top (rank 2, no thermals): 75.51,50.11 75.51,48.21 75.64,48.08 75.64,46.94 75.51,46.81 73.1,46.81 73.1,48.08 73.74,48.08 74.5,48.84 74.5,50.11 74.75,50.37 75.26,50.37
EN1  (via drill 0.6)
  Top 0.254: IC2.P23 9.98,84.92 9.6,85.29 7.82,85.29 v7.32,84.79 | JP7.1 17.73,60.91 24.46,60.91 v26.11,62.56 | v38.81,53.29 39.6,52.5 39.6,51.89 42.44,49.05 43.65,49.05 45.64,47.06 45.64,46.58 IC1.81
  Route2 0.254: v38.81,53.29 38.81,56.59 32.59,62.81 27.25,62.81 27,62.56 v26.11,62.56
  Route15 0.254: v7.32,84.79 6.3,83.77 6.3,70.56 7.32,69.55 JP7.1
EN2  (via drill 0.6)
  Top 0.254: IC3.P23 28.52,84.88 28.11,85.29 26.37,85.29 v25.86,84.79 | v55.19,36.27 56.46,36.27 56.72,36.02 58.33,36.02 IC1.48 | IC1.48
  Route15 0.254: v25.86,84.79 24.84,83.77 24.84,70.82 26.11,69.55 JP9.1 | v55.19,36.27 55.19,37.03 55.45,37.29 55.45,41.61 52.78,44.27 52.78,46.43 51.38,47.83 51.38,48.46 50.62,49.23 47.92,49.23 42.97,54.18 41.33,54.18 34.67,60.83 31.65,60.83 v30.81,61.67
  Bottom 0.254: v30.81,61.67 30.81,62.05 28.65,64.21 28.65,68.53 JP9.1
EN3  (via drill 0.6)
  Top 0.254: IC5.P23 47.06,84.88 46.65,85.29 44.91,85.29 v44.4,84.79 | v54.56,41.1 55.32,40.34 55.86,40.34 IC1.59 | IC1.59
  Route15 0.254: v44.4,84.79 43.38,83.77 43.38,70.82 44.65,69.55 JP12.1
  Bottom 0.254: v54.56,41.1 54.56,42.11 53.13,43.54 53.13,46.18 51.41,47.91 51.41,48.94 49.8,50.55 48,50.55 46.99,51.56 46.99,56.57 46.46,57.09 46.46,58.38 46.99,58.9 46.99,68.73 JP12.1
EN4  (via drill 0.6)
  Top 0.254: IC6.P23 65.6,84.92 65.23,85.29 63.45,85.29 v62.94,84.79 | 55.75,38.81 v54.56,38.81 | 55.75,38.81 | IC1.57 55.75,38.81
  Route15 0.254: v62.94,84.79 61.93,83.77 61.93,71.07 63.45,69.55 JP15.1
  Bottom 0.254: v54.56,38.81 56.08,40.34 56.08,42.11 54.05,44.15 54.05,47.45 58.09,51.48 58.09,54.43 59,55.35 59,64.08 64.47,69.55 JP15.1
EN5  (via drill 0.6)
  Top 0.254: v81.48,84.79 81.99,85.29 83.77,85.29 84.15,84.92 IC12.P23 | v49.1,48.21 49.96,47.35 49.96,46.06 49.1,45.2 49.1,39.19 51.77,36.53 53.8,36.53 54.43,35.89 54.43,35.13 53.8,34.49 52.27,34.49 47.96,38.81 47.96,39.32 46.18,41.1 46.18,43.22 IC1.85
  Route2 0.254: v66.37,67.39 65.99,67.01 61.37,67.01 56.49,62.13 56.49,60.78 56.75,60.52 56.75,58.21 58.78,56.19 58.78,55.5 58.18,54.9 58.18,52.06 53.18,47.07 50.24,47.07 v49.1,48.21
  Route15 0.254: JP18.1 81.99,69.55 80.47,71.07 80.47,83.77 v81.48,84.79
  Bottom 0.254: v66.37,67.39 81.1,67.39 JP18.1
ENET_CRS
  Top 0.254: R60.2 36.87,52.78 40.28,49.37 40.28,47.68 39.95,47.36 39.95,44.49 | IC1.92 39.95,44.49 | 39.95,44.49
ENET_MDC  (via drill 0.6)
  Top 0.254: v46.18,39.83 45.46,40.54 45.46,42.52 IC1.87 | v30.81,52.78 30.16,52.13 IC8.13
  Bottom 0.254: v46.18,39.83 40.08,39.83 39.57,39.32 37.03,39.32 34.26,42.09 34.26,46.45 32.16,48.55 32.14,48.55 31.45,49.25 31.45,52.15 v30.81,52.78
ENET_MDIO  (via drill 0.6)
  Top 0.254: IC8.12 30.91,51.57 32.88,53.54 33.52,53.54 R52.1 35.68,55.7 v36.65,55.7 | v41.61,48.72 41.61,47.7 44.15,45.16 44.15,44.54 IC1.86 | IC1.86
  Bottom 0.254: v36.65,55.7 36.65,53.67 v41.61,48.72
ENET_REF_CLK
  Top 0.254: 43.49,43.78 43.49,45.05 40.77,47.78 40.77,49.91 37.9,52.78 37.9,53.81 38.71,54.62 38.71,56.15 37.85,57.01 R51.2 | IC1.88 43.49,43.78 | 43.49,43.78
ENET_RX_ER  (via drill 0.6)
  Top 0.254: 42.88,43.69 42.88,44.91 42.24,45.54 41.86,45.54 v40.84,46.56 | R53.1 32.98,51.26 v32.6,50.88 31.7,49.98 IC8.10 | IC1.89 42.88,43.69 | 42.88,43.69
  Bottom 0.254: v40.84,46.56 40.21,47.19 39.95,47.19 38.3,48.84 36.91,48.84 34.88,50.88 v32.6,50.88
ENET_RXD0  (via drill 0.6)
  Top 0.254: 41.54,43.62 | v40.84,45.29 40.84,44.31 41.54,43.62 | v37.54,45.92 R58.2 | IC1.91 41.54,43.62
  Bottom 0.254: v40.84,45.29 40.21,45.92 v37.54,45.92
ENET_RXD1  (via drill 0.6)
  Top 0.254: v41.99,44.4 42.37,44.02 42.37,43.49 | v37.54,44.4 R59.2 | IC1.90 42.37,43.49 | 42.37,43.49
  Bottom 0.254: v41.99,44.4 v37.54,44.4
ENET_TX_EN  (via drill 0.6)
  Top 0.254: IC8.16 28.66,55.07 v28.91,55.32 | v39.45,48.97 39.5,48.92 39.5,44.24 | IC1.93 39.5,44.24 | 39.5,44.24
  Bottom 0.254: v39.45,48.97 38.07,50.35 38.07,51.58 35.11,54.54 29.69,54.54 v28.91,55.32
ENET_TXD0  (via drill 0.6)
  Top 0.254: v27.38,54.05 27.38,53.8 28.16,53.02 IC8.17 | IC1.95 40.74,41.59 40.74,41.61 38.58,43.77 38.58,47.66 38.1,48.15 38.1,48.92 v37.29,49.73
  Bottom 0.254: v27.38,54.05 28.14,54.05 28.57,53.62 33.4,53.62 v37.29,49.73
ENET_TXD1  (via drill 0.6)
  Top 0.254: v37.29,51.26 38.56,49.99 38.56,48.34 39.04,47.85 39.04,43.99 | IC8.18 27.66,52.25 26.11,53.8 v26.11,54.05 | 39.04,43.99 | IC1.94 39.04,43.99
  Bottom 0.254: v26.11,54.05 27,54.94 28.02,54.94 28.88,54.08 34.46,54.08 v37.29,51.26
ETA_CURRENT
  Top 0.254: JP34.3 52.53,56.08 54.14,56.08 54.32,56.26 IC9.2
GND  (via drill 0.6)
  Top 0.254: Q2.GND2 44.27,25.44 C2.2 42.37,25.34 40.84,23.81 C13.1 | Q2.GND1 48.41,23.79 C3.2 | v11.38,18.24 VD1.2 | v16.97,19.13 15.48,19.13 C85.1 | C79.2 v17.22,6.3 | C78.2 19.25,14.01 v19.25,14.43 | C80.2 v25.1,14.43 | S1.3 49.99,10.24 | 49.99,10.24 S1.4 | S2.4 S2.3 | JP25.2 49.99,10.24 | IC7.3 33.54,57.42 33.1,57.86 30.9,57.86 C44.2 29.2,57.86 23.32,57.86 JP6.3 | R27.2 31.45,72.09 v32.21,71.32 | C15.1 9.86,72.09 v9.09,71.32 | R26.2 12.9,72.09 v12.14,71.32 | C16.1 28.4,72.09 v27.64,71.32 | v47.7,42.37 47.7,43.11 | 25.22,36.78 C56.2 25.39,36.7 v26.87,38.18 | C57.2 25.31,32.93 v24.59,32.21 | R90.2 69.93,15.99 Q6.S | R72.1 60.57,17.86 59.55,16.84 R91.2 | Q5.S 86.73,47.36 R86.2 | C65.2 51.26,52.11 JP8.2 | IC4.13 41.76,58.27 v42.37,58.88 43.71,58.88 | IC4.16 43.71,58.88 | 43.71,58.88 44.15,58.88 45.01,58.01 IC4.18 45.01,56.58 C31.1 | C32.1 46.94,72.09 v46.18,71.32 | R40.2 49.99,72.09 v50.75,71.32 | C33.1 65.48,72.09 v64.72,71.32 | R43.2 68.53,72.09 v67.77,71.32 | C72.1 84.02,72.09 v83.26,71.32 | R19.2 87.07,72.09 v86.31,71.32 | IC9.8 58.22,58.65 v57.99,58.88 57.57,58.46 IC9.7 | v18.75,37.8 18.75,38.39 20.45,40.1 20.46,40.1 C55.2 23.99,43.64 C54.2 26.02,43.64 C59.2 | v30.81,46.69 31.7,45.8 31.7,45.24 32.53,44.41 32.53,42.03 C58.2 | C25.2 18.24,72 v18.24,71.32 | C38.2 55.32,72 v55.32,71.32 | C71.2 91.64,72.09 v92.41,71.32 | C41.2 73.1,72.72 73.86,71.96 v73.86,71.32 | C28.2 36.78,72 v36.78,71.32 | C46.2 21.45,46.69 C1.1 20.14,46.65 20.14,47.07 | IC9.3 54.97,56.18 JP34.1 | v21.79,18.49 21.79,18.4 21.12,17.73 C5.1 | JP10.4 57.86,22.05 57.86,24.08 57.1,24.84 56.85,24.84 55.79,25.89 55.79,27.07 54.72,28.14 54.18,28.14 IC1.31
  Top 0.254: 57.48,39.08 57.48,39.12 59.39,41.03 59.39,41.22 v59,41.61 | IC9.18 54.97,64.22 C68.1 | IC4.8 41.76,64.24 41.86,64.34 42.24,64.34 42.41,64.17 IC4.7 42.41,62.09 v41.86,61.54 42.37,62.05 44.27,62.05 44.36,62.14 | 44.36,62.14 IC4.4 | IC4.3 45.01,62.15 44.91,62.05 44.44,62.05 44.36,62.14 | R74.2 77.93,21.2 R87.1 | IC1.83 45.18,45.63 45.18,46.66 44.18,47.67 C12.1 | IC1.41 58.71,30.68 59.39,30.68 60.4,29.67 C9.1 | IC1.97 40.58,40.34 v38.81,40.34
  Top 0.406: C59.2 25.3,43.73 25.21,43.63 25.21,41.31 25.44,41.07 30.05,41.07 30.05,42.03 Q3.GND2 | v8.97,13.67 8.36,14.27 8.36,14.29 7.65,15.01 J12.GND2 | J12.GND 8.89,21.46 v8.97,21.54
  Top 0.508: v81.23,18.49 81.23,19 80.81,19.42 R74.2 79.41,19.42
  Route15 0.254: JP14.2 17.22,5.41 v17.22,6.3
  other vias: 13.79,13.41 19.76,90.12 19.76,91.9 22.81,90.12 22.81,91.9 9.86,81.74 9.86,80.21 8.59,80.98 8.59,79.45 7.32,80.21 7.32,78.69 7.32,83.26 8.59,82.5 7.32,81.74 25.35,87.58 27.89,93.68 35,93.68 28.91,93.68 33.99,93.68 6.81,87.58 9.35,93.68 16.46,93.68 10.36,93.68 15.44,93.68 15.95,80.21 15.95,81.74 17.22,80.98 17.22,82.5 18.49,81.74 18.49,83.26 18.49,78.69 17.22,79.45 18.49,80.21 28.4,81.74 28.4,80.21 27.13,80.98 27.13,79.45 25.86,80.21 25.86,78.69 25.86,83.26 27.13,82.5 25.86,81.74 34.49,80.21 34.49,81.74 35.76,80.98 35.76,82.5 37.03,81.74 37.03,83.26 37.03,78.69 35.76,79.45 37.03,80.21 38.3,90.12 38.3,91.9 41.35,90.12 41.35,91.9 43.89,87.58 46.43,93.68 53.54,93.68 47.45,93.68 52.53,93.68 46.94,81.74 46.94,80.21 45.67,80.98 45.67,79.45 44.4,80.21 44.4,78.69 44.4,83.26 45.67,82.5 44.4,81.74 53.04,80.21 53.04,81.74 54.31,80.98 54.31,82.5 55.58,81.74 55.58,83.26 55.58,78.69 54.31,79.45 55.58,80.21 56.85,90.12 56.85,91.9 59.89,90.12 59.89,91.9 62.43,87.58 64.97,93.68 72.09,93.68 65.99,93.68 71.07,93.68 65.48,81.74 65.48,80.21 64.21,80.98 64.21,79.45 62.94,80.21 62.94,78.69 62.94,83.26 64.21,82.5 62.94,81.74 71.58,80.21 71.58,81.74 72.85,80.98 72.85,82.5 74.12,81.74 74.12,83.26 74.12,78.69 72.85,79.45 74.12,80.21 75.39,90.12 75.39,91.9 78.44,90.12 78.44,91.9 80.98,87.58 83.52,93.68 90.63,93.68 84.53,93.68 89.61,93.68 84.02,81.74 84.02,80.21 82.75,80.98 82.75,79.45 81.48,80.21 81.48,78.69 81.48,83.26 82.75,82.5 81.48,81.74 90.12,80.21 90.12,81.74 91.39,80.98 91.39,82.5 92.66,81.74 92.66,83.26 92.66,78.69 91.39,79.45 92.66,80.21 93.93,90.12 93.93,91.9 96.98,90.12 96.98,91.9 21.03,51.77 55.32,34.24 78.94,52.4 78.94,53.92 80.21,53.16 80.21,54.69 81.48,53.92 80.21,51.64 81.48,52.4 76.66,51.64 76.66,52.65 75.64,52.65 75.64,51.64 74.63,52.65 74.63,51.64 82.5,18.49 83.77,19.76 85.04,19.76 83.77,28.52 85.04,28.52 82.5,27.25 81.23,27.25 82.5,36.02 81.23,36.02 83.77,37.29 85.04,37.29 83.77,36.02 85.04,36.02 83.77,27.25 85.04,27.25 83.77,18.49 85.04,18.49 57.99,11.89 56.72,10.62 57.99,13.16 57.99,10.62 57.99,14.43 68.4,14.81 68.4,13.54 68.4,12.27 67.13,14.81 67.13,13.54 84.91,45.92 86.31,45.92 84.91,44.4 86.31,44.4 87.71,45.92 87.71,44.4 94.18,66.37 95.45,66.37 95.45,62.81 96.72,66.37 94.18,62.81 92.91,62.81 92.91,66.37 96.72,62.81 97.74,65.35 97.74,63.83 95.2,64.59 96.34,64.59 27.76,43.64 4.52,20.52 4.52,15.95 13.79,20.9 63.07,60.53 61.29,60.53 63.07,63.58 61.29,63.58 84.91,15.82 82.75,15.82 29.92,38.18 31.7,38.18 33.48,38.18 31.7,39.95 11.38,81.74 11.38,80.21 12.9,81.74 12.9,80.21 14.43,81.74 14.43,80.21 29.92,81.74 29.92,80.21 31.45,81.74 31.45,80.21 32.97,81.74 32.97,80.21 48.46,81.74 48.46,80.21 49.99,81.74 49.99,80.21 51.51,81.74 51.51,80.21 67.01,81.74 67.01,80.21 68.53,81.74 68.53,80.21 70.05,81.74 70.05,80.21 85.55,81.74 85.55,80.21 87.07,81.74 87.07,80.21 88.6,81.74 88.6,80.21 28.91,49.73 56.72,11.89 56.72,13.16 56.72,14.43 57.35,9.47 67.13,12.27 84.91,42.88 86.31,42.88 87.71,42.88 81.74,5.79 81.74,4.52 78.18,4.52 81.74,3.25 78.18,5.79 78.18,7.06 81.74,7.06 78.18,3.25 79.96,4.78 79.96,3.63 80.72,8.08 79.2,8.08 81.74,1.22 78.18,1.22 80.72,2.24 79.2,2.24 79.96,1.22 86.56,65.61 85.29,65.61 84.02,65.61 6.05,32.21 3,32.21 3,35.26 3,29.16 3,26.11 3,38.3 9.09,32.21 12.14,32.21 15.19,32.21 15.19,29.16 15.19,35.26 18.24,26.11 3.51,53.8 3.51,51.51 3.51,49.23 15.19,44.91 12.14,44.91 9.09,44.91 6.05,44.91 3,44.91 10.62,46.94 13.67,46.94 10.62,53.42 13.67,53.42 18.24,57.61 4.52,42.88 7.57,42.88 10.62,42.88 13.67,42.88 1.22,20.52 1.22,15.95 3,82.25 3,86.82 3,91.39 63.7,56.08 63.7,54.56 96.34,16.84 95.07,16.84 86.31,18.49 87.58,18.49 86.31,19.76 35.26,38.18 40.84,22.17 49.86,24.61 44.78,27.13 77.8,66.37 66.5,57.61 63.7,57.61 65.1,56.85 67.77,56.85 35.64,47.83 1.22,52.65 1.22,50.37 1.22,48.08 7.57,46.94 3.51,46.94 7.57,53.42 9.09,54.56 12.01,54.56 1.22,36.78 1.22,33.73 1.22,30.68 1.22,27.64
  pour Top: 39.07,88.6 37.8,89.87 37.8,92.66 38.81,93.68 40.84,93.68 41.86,92.66 41.86,89.87 40.59,88.6
  pour Top (no thermals): 45.92,91.26 45.92,93.93 46.18,94.18 47.7,94.18 47.96,93.93 47.96,91.26
  pour Top (no thermals): 54.05,91.26 54.05,93.93 53.8,94.18 52.27,94.18 52.02,93.93 52.02,91.26
  pour Top (no thermals): 43.64,87.07 43.38,87.33 43.38,88.72 44.65,89.99 45.67,89.99 45.67,88.85 44.78,88.85 44.4,88.47 44.4,87.33 44.15,87.07
  pour Top (no thermals): 72.34,58.37 72.97,57.73 72.97,56.21 72.59,55.83 71.58,55.83 70.94,55.19 70.94,54.31 70.59,53.95 65.48,53.95 65.48,58.37
  pour Top (rank 5, no thermals): 78.44,57.23 79.58,57.23 83.13,53.67 83.13,44.02 82.88,43.76 75.01,43.76 74.37,44.4 74.37,46.43 75.64,46.43 75.64,44.91 75.77,44.78 78.94,44.78 79.2,45.03 79.2,46.43 78.82,46.81 77.55,46.81 77.55,48.21 80.47,48.21 80.47,46.3 81.23,46.3 82.12,47.19 82.12,49.99 81.74,50.37 73.99,50.37 73.48,50.88 73.48,53.16 74.12,53.8 76.53,53.8 76.91,54.18 76.91,55.32 77.42,55.83 77.93,55.83 78.44,56.34
  pour Top (no thermals): 80.72,37.54 80.72,35.76 80.98,35.51 85.29,35.51 85.55,35.76 85.55,37.54 85.29,37.8 80.98,37.8
  pour Top (no thermals): 80.72,28.78 80.72,27 80.98,26.75 85.29,26.75 85.55,27 85.55,28.78 85.29,29.03 80.98,29.03
  pour Top (no thermals): 80.59,19.89 80.59,18.24 80.98,17.86 85.29,17.86 85.67,18.24 85.67,20.02 85.42,20.27 80.98,20.27
  pour Bottom (no thermals): 92.66,62.31 91.26,63.7 91.26,66.62 92.15,67.51 99.26,67.51 99.64,67.13 99.64,62.69 99.26,62.31
  pour Bottom (rank 6): 100.79,-0.81 -0.81,-0.81 -0.81,100.28 100.79,100.28
  pour Top (rank 6): 100.79,-0.56 -0.81,-0.56 -0.81,100.53 100.79,100.53
  pour Route2 (rank 6): 100.79,-0.56 -0.81,-0.56 -0.81,100.53 100.79,100.53
  pour Top: 64.47,60.91 63.58,60.02 60.91,60.02 59.89,61.04 59.89,63.07 60.91,64.08 63.58,64.08 64.47,63.2
  pour Top (no thermals): 85.29,48.46 87.96,48.46 88.34,48.08 88.34,42.24 87.96,41.86 83.9,41.86 83.52,42.24 83.52,47.96 83.77,48.21 85.04,48.21
  pour Top (no thermals): 60.53,14.94 60.15,15.32 56.46,15.32 56.08,14.94 56.08,9.22 56.46,8.84 57.61,8.84 60.53,11.76
  pour Top (no thermals): 70.94,12.14 70.31,11.51 67.01,11.51 66.5,12.01 66.5,15.06 66.88,15.44 70.56,15.44 70.94,15.06
  pour Top (rank 4, no thermals): 91.64,13.16 91.64,16.84 101.93,16.84 101.93,13.16
  pour Top (no thermals): 99.26,67.51 99.64,67.13 99.64,62.69 99.26,62.31 92.66,62.31 91.26,63.7 91.26,67.13 91.64,67.51
  pour Bottom (no thermals): 60.53,14.94 60.15,15.32 56.46,15.32 56.08,14.94 56.08,9.22 56.46,8.84 57.61,8.84 60.53,11.76
  pour Route2 (no thermals): 70.94,12.14 70.31,11.51 67.01,11.51 66.5,12.01 66.5,15.06 66.88,15.44 70.56,15.44 70.94,15.06
  pour Route2 (no thermals): 91.64,67.51 99.77,67.51 99.77,62.43 92.66,62.43 91.64,63.45
  pour Route2 (no thermals): 60.53,14.94 60.15,15.32 56.46,15.32 56.08,14.94 56.08,9.22 56.46,8.84 57.61,8.84 60.53,11.76
  pour Bottom (no thermals): 70.94,12.14 70.31,11.51 67.01,11.51 66.5,12.01 66.5,15.06 66.88,15.44 70.56,15.44 70.94,15.06
  pour Top (no thermals): 77.67,8.33 77.93,8.59 81.99,8.59 82.25,8.33 82.25,0.97 81.86,0.58 78.05,0.58 77.67,0.97
  pour Bottom (no thermals): 78.05,0.58 77.67,0.97 77.67,7.7 78.69,8.71 81.1,8.71 82.25,7.57 82.25,0.97 81.86,0.58
  pour Bottom (rank 4, no thermals): 89.23,48.84 83.9,48.84 83.9,46.18 89.23,46.18
  pour Route15 (rank 4, no thermals): 61.93,3 61.54,2.62 51.89,2.62 51.51,3 51.51,9.86 61.16,19.51 71.58,19.51 72.97,20.9 72.97,33.35 83.52,43.89 83.52,55.19 85.04,56.72 85.04,59.26 92.79,67.01 99.26,67.01 99.64,66.62 99.64,55.83 99.26,55.45 92.28,55.45 90.75,53.92 90.75,45.67 88.21,43.13 88.21,15.19 87.83,14.81 78.31,14.81 75.26,11.76 66.37,11.76 61.93,7.32
  pour Route2 (rank 3, no thermals): 92.91,13.16 92.91,16.84 101.93,16.84 101.93,13.16
  pour Route15 (rank 4): 86.69,18.87 55.83,18.87 55.83,63.96 86.69,63.96
  pour Top (no thermals): 65.61,58.37 65.61,54.05 64.47,54.05 63.45,53.04 61.16,53.04 61.16,58.37
  pour Route15 (rank 3, no thermals): 51.51,-0.94 51.51,9.6 83.26,9.6 83.26,-0.94
  pour Route2 (no thermals): 78.05,0.58 77.67,0.97 77.67,7.44 78.94,8.71 81.1,8.71 82.25,7.57 82.25,0.97 81.86,0.58
  pour Route15 (no thermals): 94.44,17.09 94.82,17.48 96.6,17.48 96.98,17.09 96.98,14.55 96.6,14.17 94.82,14.17 94.44,14.55
  pour Bottom (no thermals): 94.44,17.09 94.82,17.48 96.6,17.48 96.98,17.09 96.98,14.43 96.6,14.05 94.82,14.05 94.44,14.43
  pour Top (no thermals): 65.61,60.78 70.69,60.78 71.2,61.29 72.34,61.29 72.59,61.04 72.59,58.88 72.21,58.5 65.61,58.5
  pour Top: 86.31,14.3 84.28,12.27 82.25,12.27 81.23,13.28 81.23,15.32 82.25,16.33 85.29,16.33 86.31,15.32
  pour Top (rank 5, no thermals): -3.35,85.8 102.82,85.8 102.82,76.4 -3.35,76.4
  pour Top (no thermals): 8.84,91.26 8.84,93.93 9.09,94.18 10.62,94.18 10.87,93.93 10.87,91.26
  pour Top (no thermals): 6.55,87.07 6.3,87.33 6.3,88.72 7.57,89.99 8.59,89.99 8.59,88.85 7.7,88.85 7.32,88.47 7.32,87.33 7.06,87.07
  pour Top (no thermals): 25.1,87.07 24.84,87.33 24.84,88.72 26.11,89.99 27.13,89.99 27.13,88.85 26.24,88.85 25.86,88.47 25.86,87.33 25.6,87.07
  pour Top (no thermals): 27.38,91.26 27.38,93.93 27.64,94.18 29.16,94.18 29.41,93.93 29.41,91.26
  pour Top (no thermals): 35.51,91.26 35.51,93.93 35.26,94.18 33.73,94.18 33.48,93.93 33.48,91.26
  pour Top: 20.52,88.6 19.25,89.87 19.25,92.66 20.27,93.68 22.3,93.68 23.32,92.66 23.32,89.87 22.05,88.6
  pour Top: 57.61,88.6 56.34,89.87 56.34,92.66 57.35,93.68 59.39,93.68 60.4,92.66 60.4,89.87 59.13,88.6
  pour Top (no thermals): 62.18,87.07 61.93,87.33 61.93,88.72 63.2,89.99 64.21,89.99 64.21,88.85 63.32,88.85 62.94,88.47 62.94,87.33 62.69,87.07
  pour Top (no thermals): 64.47,91.26 64.47,93.93 64.72,94.18 66.24,94.18 66.5,93.93 66.5,91.26
  pour Top (no thermals): 72.59,91.26 72.59,93.93 72.34,94.18 70.82,94.18 70.56,93.93 70.56,91.26
  pour Top: 76.15,88.6 74.88,89.87 74.88,92.66 75.9,93.68 77.93,93.68 78.94,92.66 78.94,89.87 77.67,88.6
  pour Top (no thermals): 80.72,87.07 80.47,87.33 80.47,88.72 81.74,89.99 82.75,89.99 82.75,88.85 81.86,88.85 81.48,88.47 81.48,87.33 81.23,87.07
  pour Top (no thermals): 83.01,91.26 83.01,93.93 83.26,94.18 84.79,94.18 85.04,93.93 85.04,91.26
  pour Top (no thermals): 91.14,91.26 91.14,93.93 90.88,94.18 89.36,94.18 89.1,93.93 89.1,91.26
  pour Top: 94.69,88.6 93.42,89.87 93.42,92.66 94.44,93.68 96.47,93.68 97.49,92.66 97.49,89.87 96.22,88.6
  pour Top (no thermals): 16.97,91.26 16.97,93.93 16.71,94.18 15.19,94.18 14.94,93.93 14.94,91.26
GPIO_FET
  Top 0.254: Q7.G 64.59,14.72 R70.2 R91.1
GPIO_FET1
  Top 0.254: R86.1 R88.1 85.64,52.53 Q5.G
ISP_BOOT  (via drill 0.6)
  Top 0.254: R15.1 46.85,17.82 47.45,17.22 S2.2 S2.1 52.91,15.82 54.31,17.22 v54.31,18.49 | v58.37,37.54 58.37,38.6 IC1.53 | IC1.53
  Route2 0.254: v58.37,37.54 57.45,36.62 57.45,34.75 53.82,31.12 53.82,26.48 53.27,25.93 53.27,25.28 53.82,24.73 53.82,18.97 v54.31,18.49
  Bottom 0.254: v54.31,18.49 52.53,16.71 JP25.3
JTAG-RTCK
  Top 0.254: 38.75,36.97 40.26,38.49 IC1.100
  Top 0.673: 38.11,36.33 38.75,36.97
JTAG-TCK
  Top 0.254: 40.65,32.52 40.84,32.52 40.84,33.8 IC1.5
  Top 0.673: 40.65,32.52 40.02,31.89
JTAG-TDI
  Top 0.254: 39.67,34.75 39.07,34.75 38.75,34.43 | 39.67,34.75 | IC1.2 39.67,34.75
  Top 0.673: 38.75,34.43 38.11,33.8
JTAG-TDO
  Top 0.254: IC1.1 39.91,35.7 38.75,35.7
  Top 0.673: 38.75,35.7 38.11,35.07
JTAG-TMS